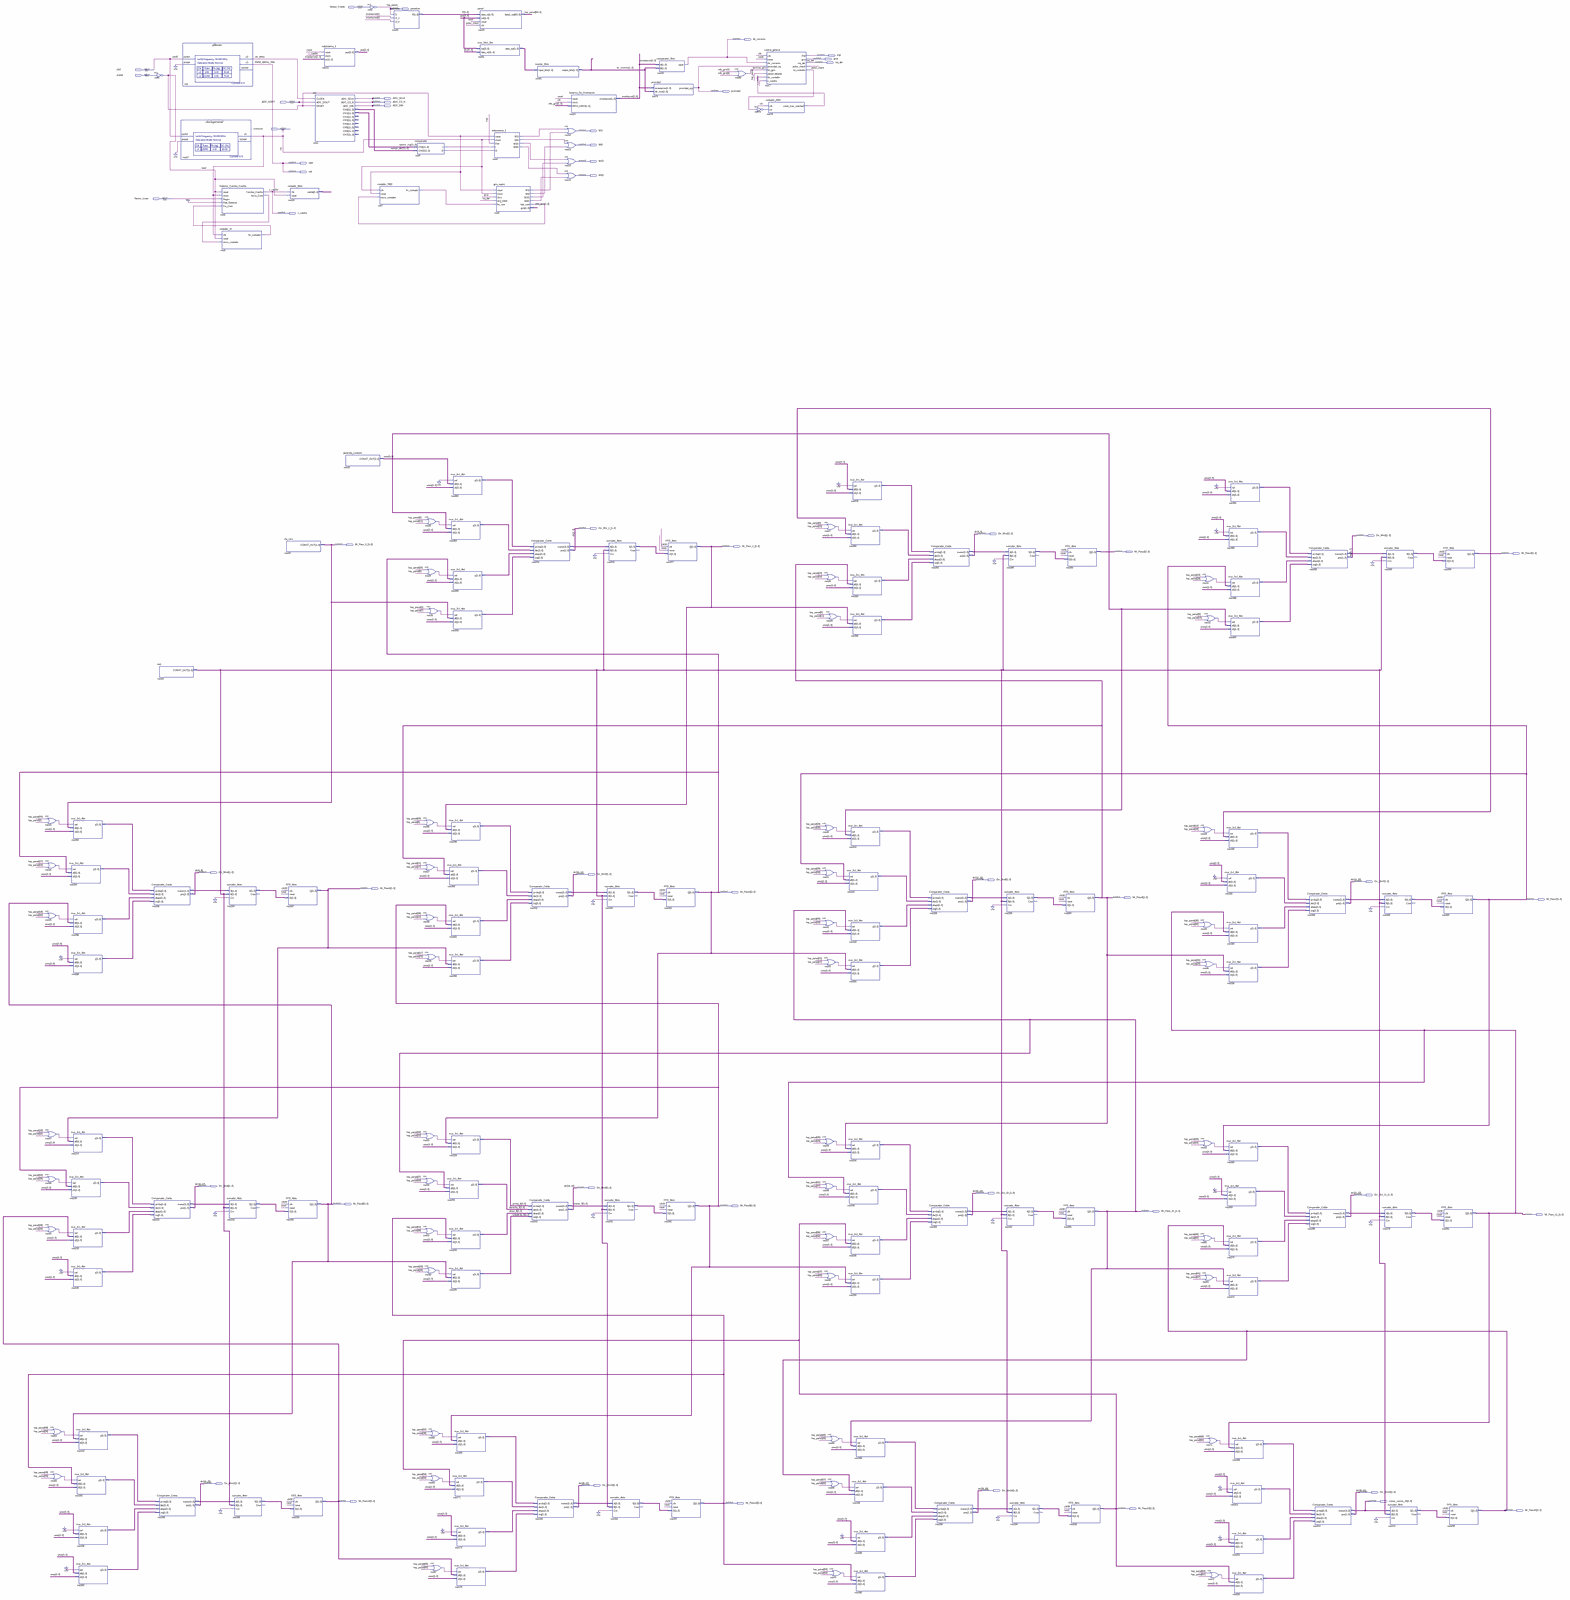
[diagram p0: schematic sheet, whole]
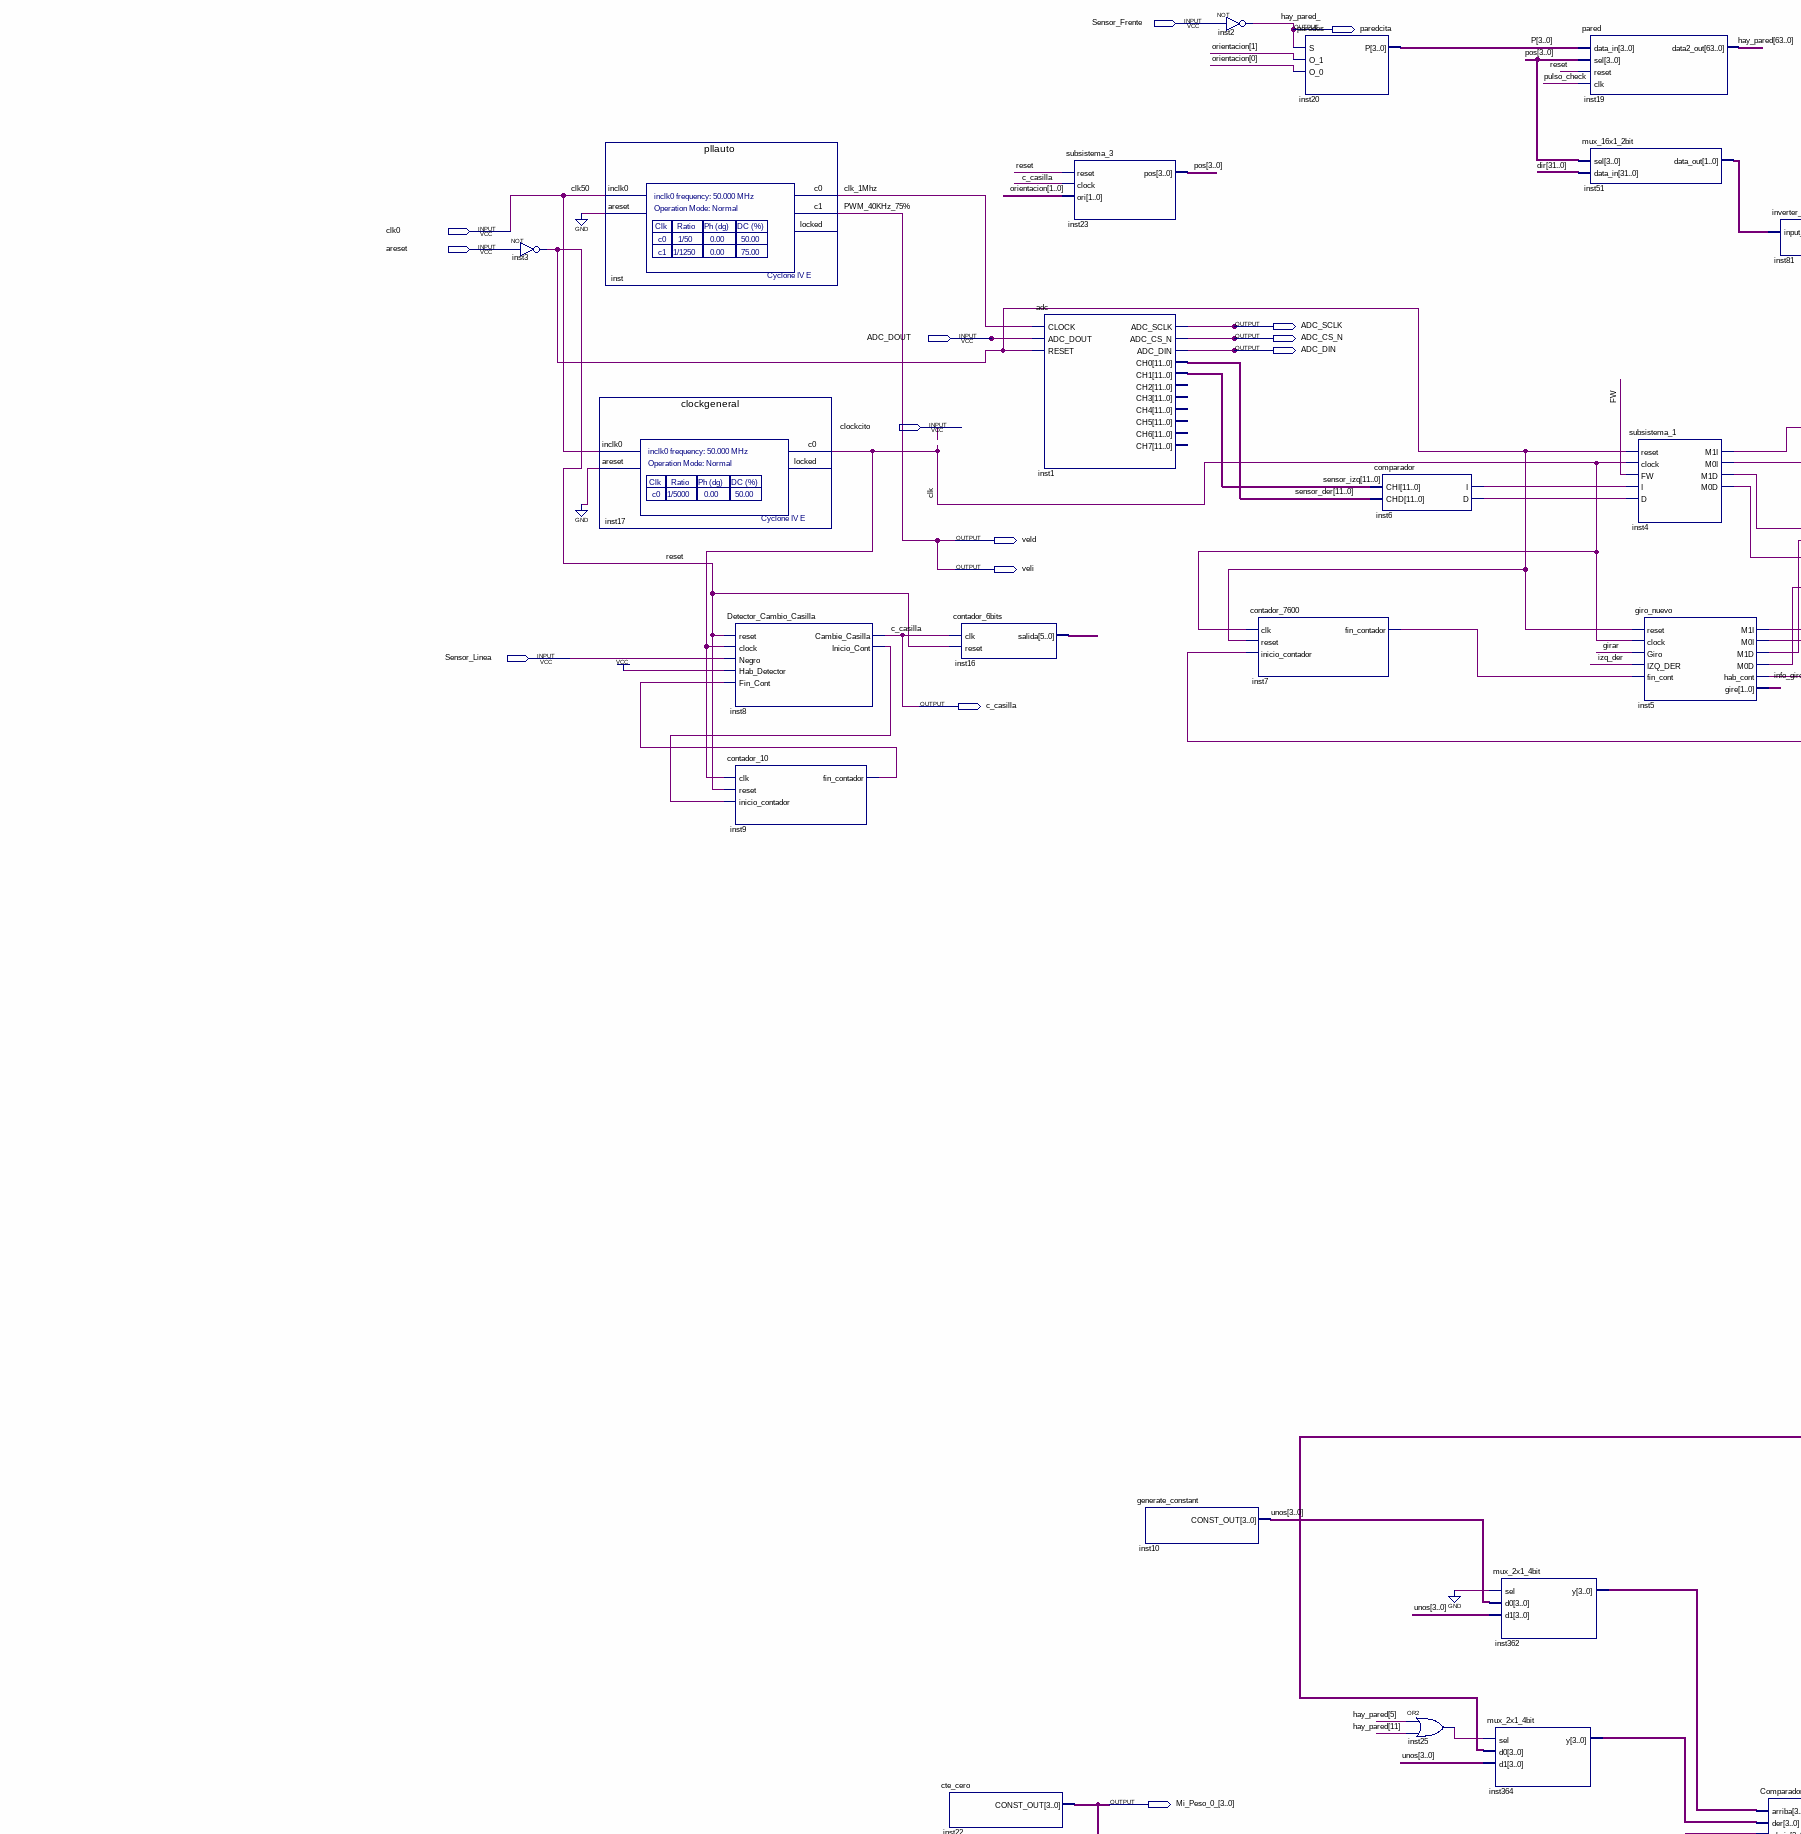
[diagram p1: schematic sheet, upper left part]
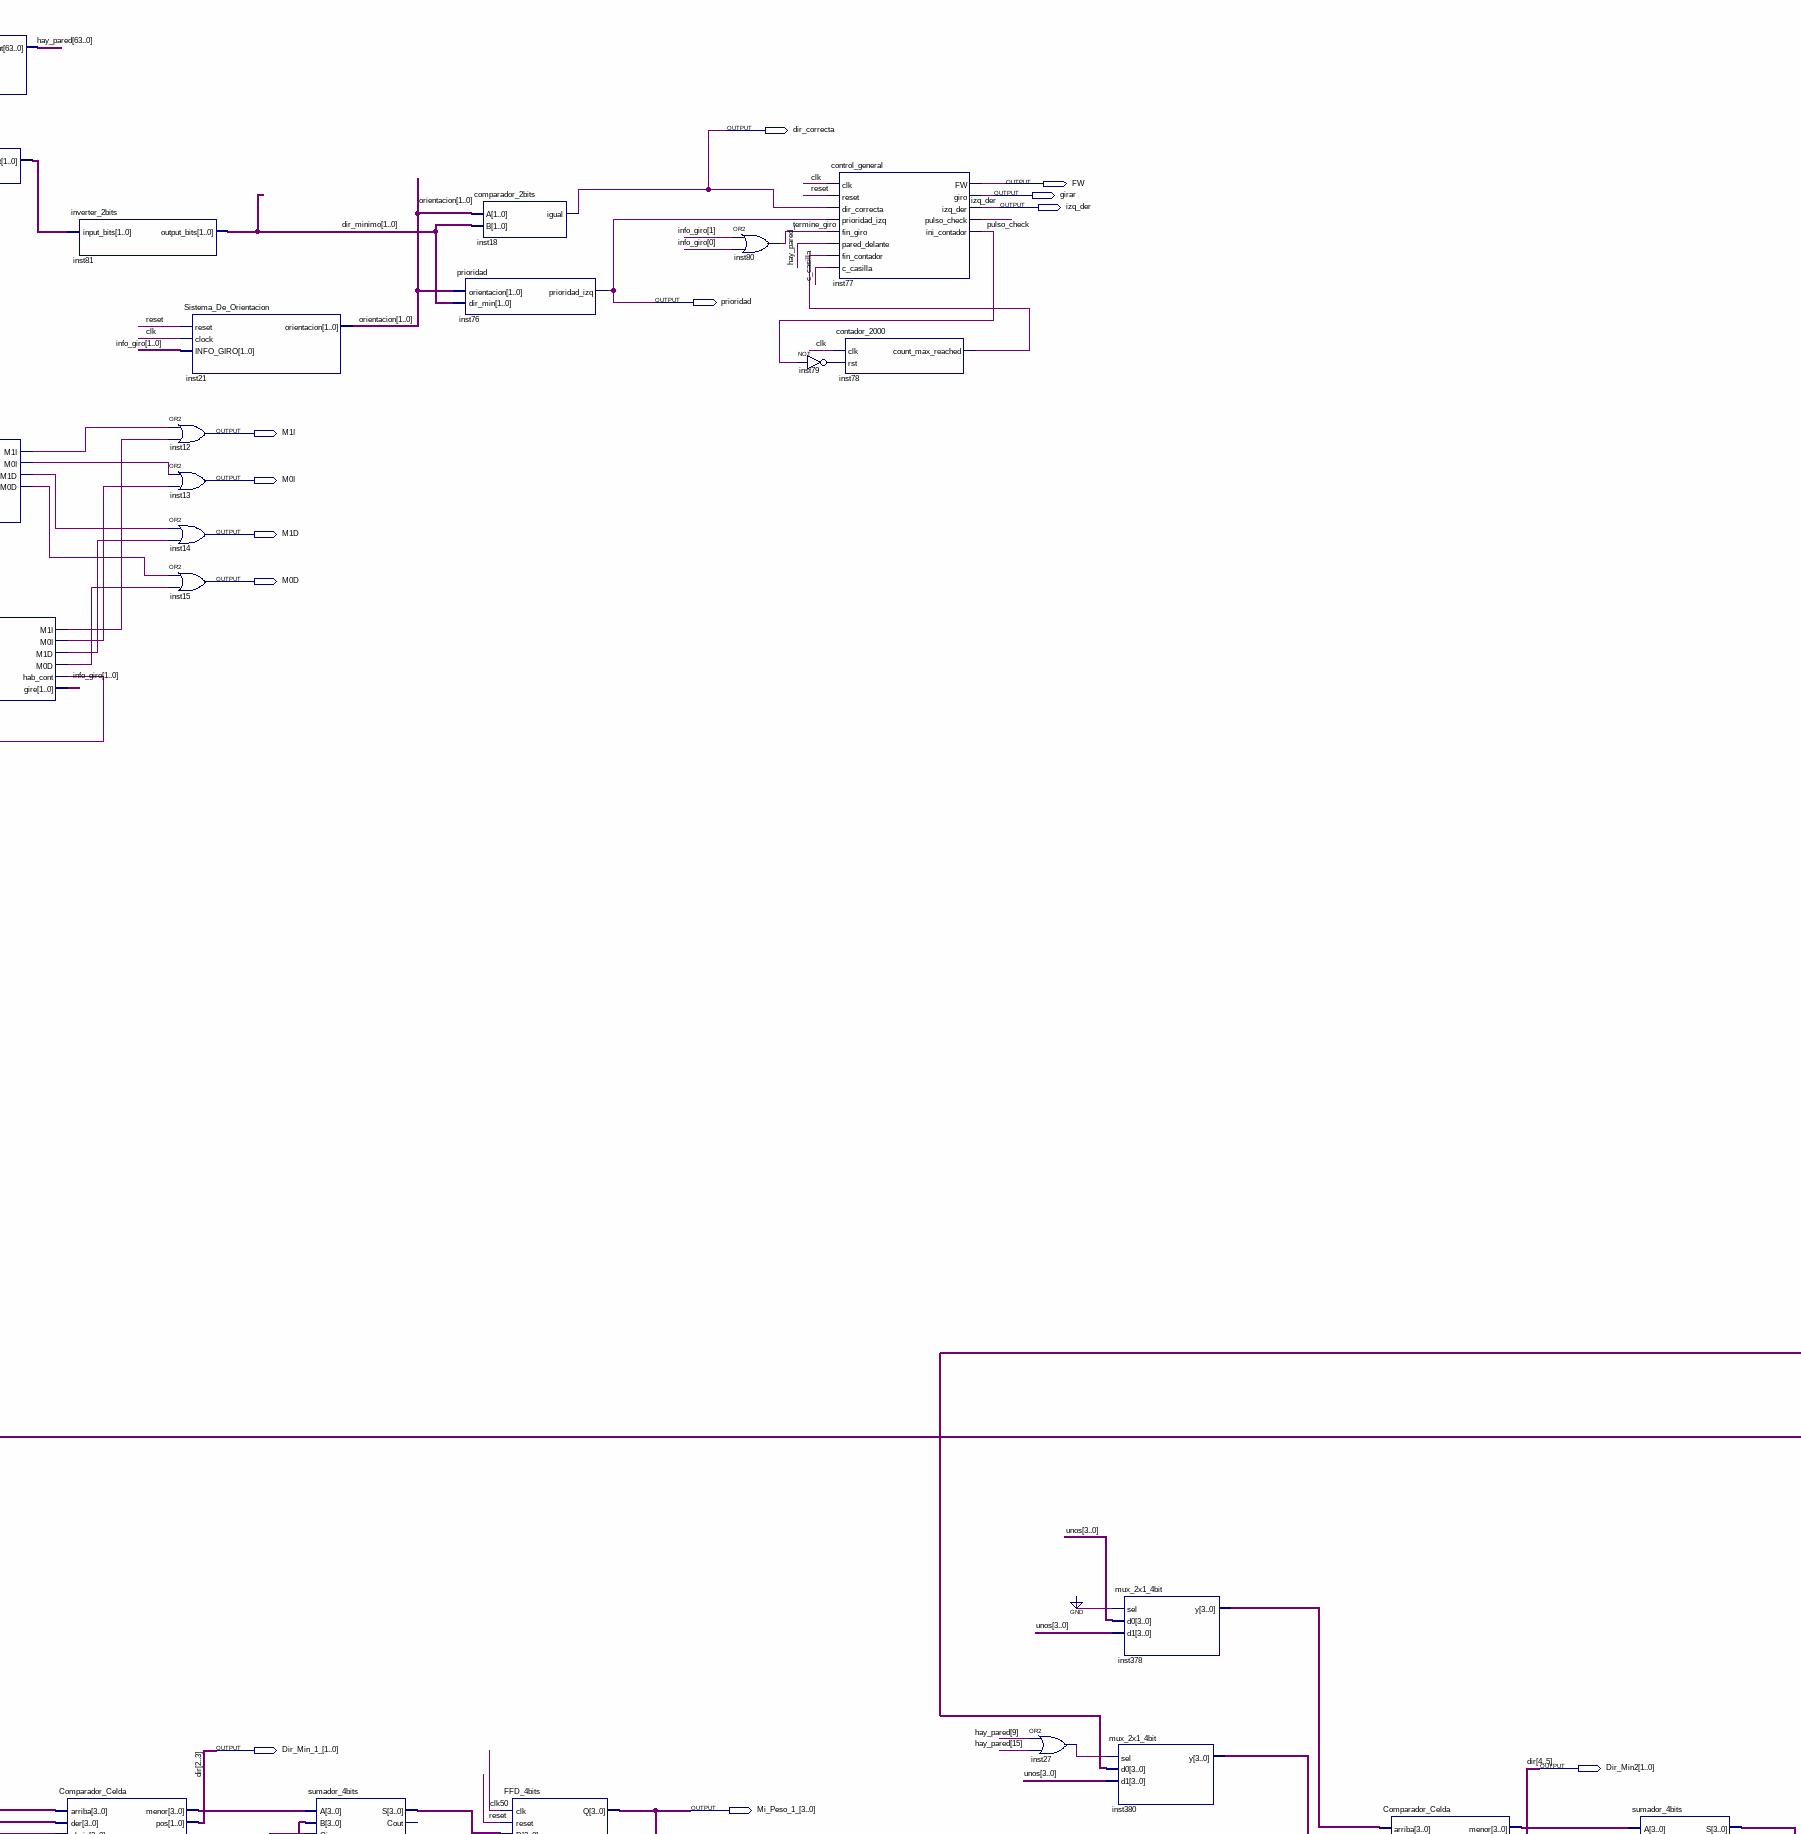
[diagram p2: schematic sheet, upper centre part]
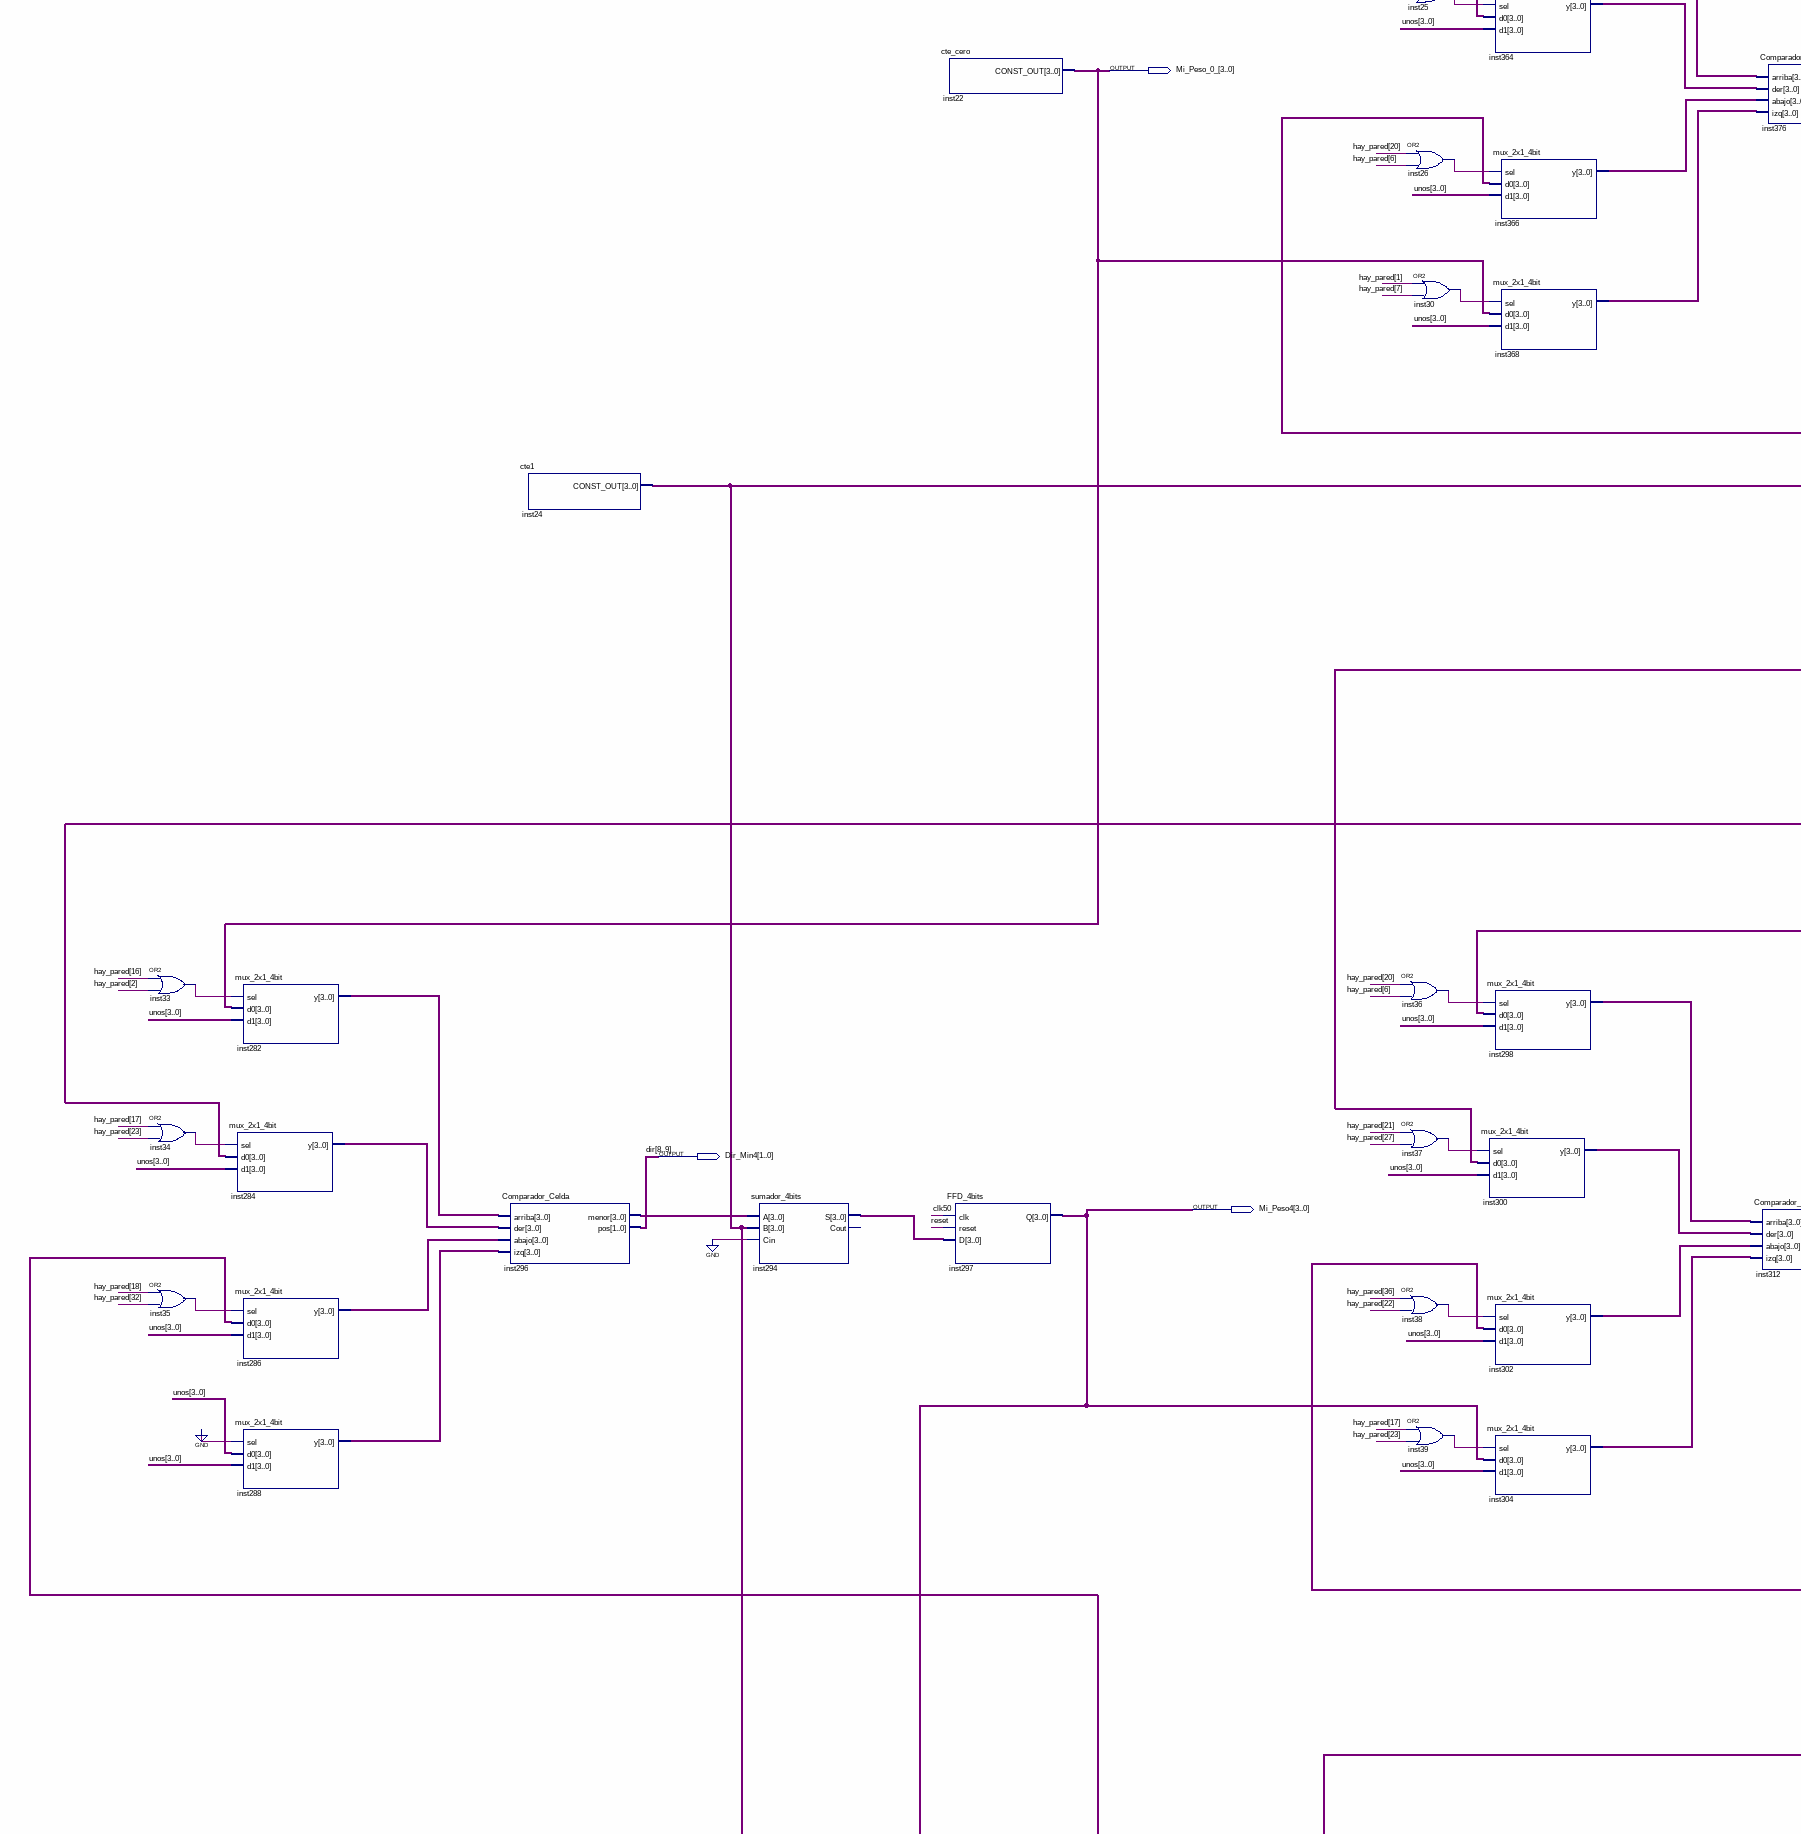
[diagram p3: schematic sheet, middle left part]
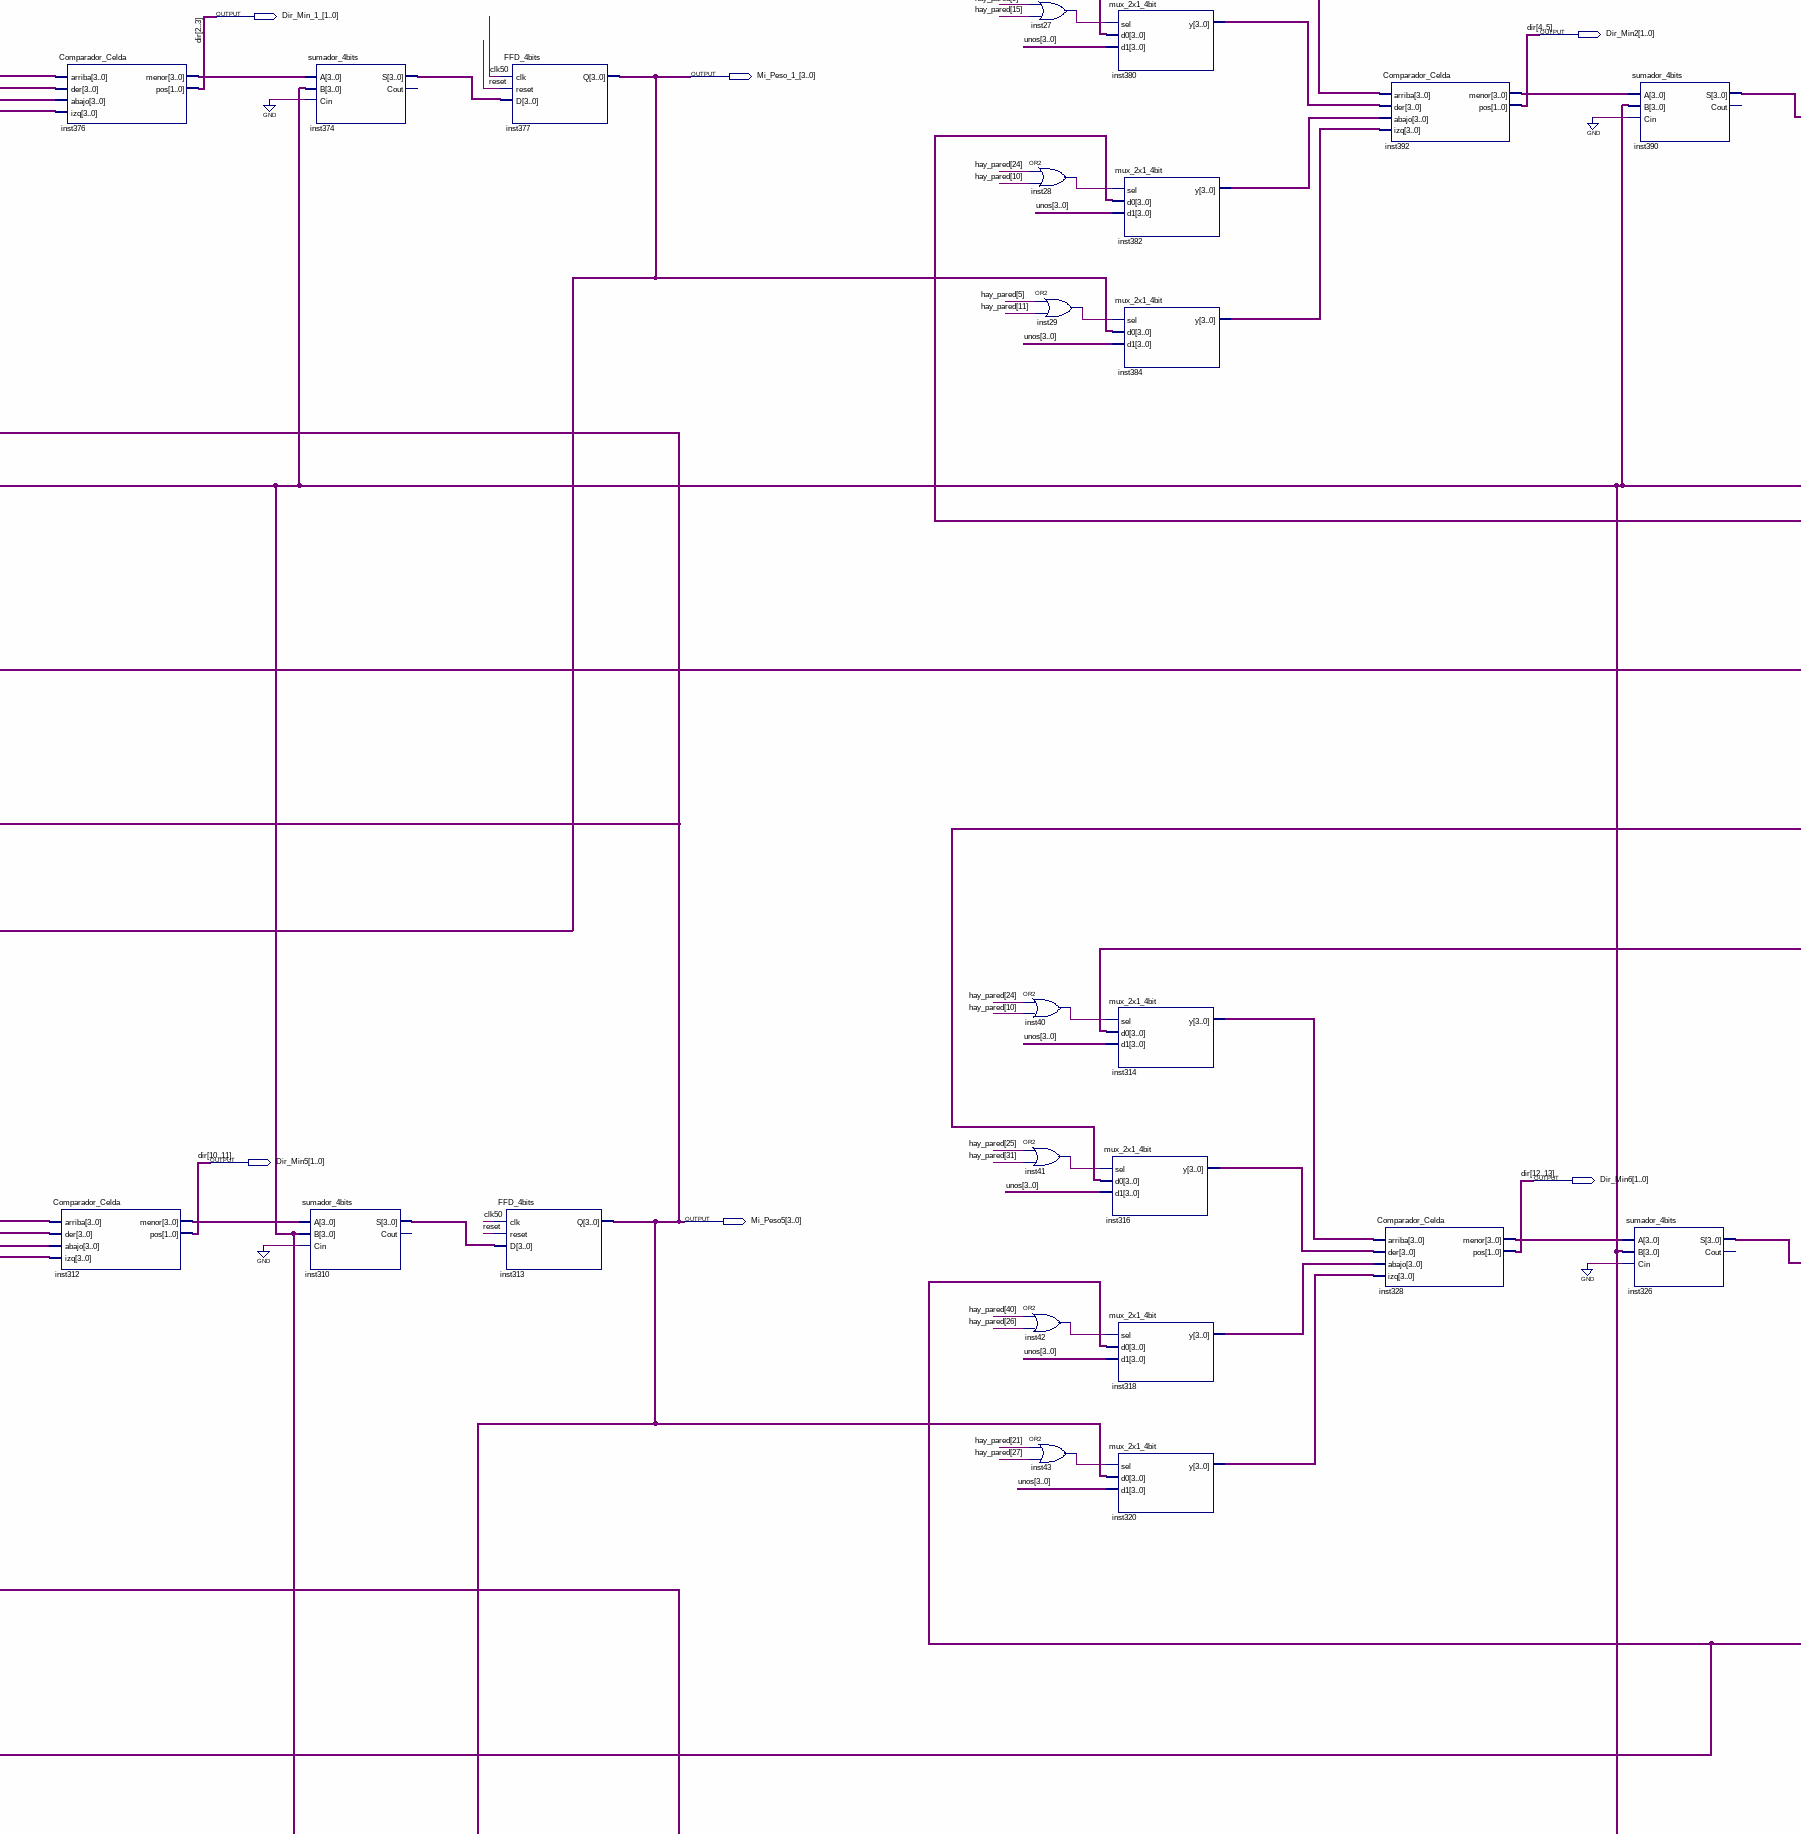
[diagram p4: schematic sheet, middle centre part]
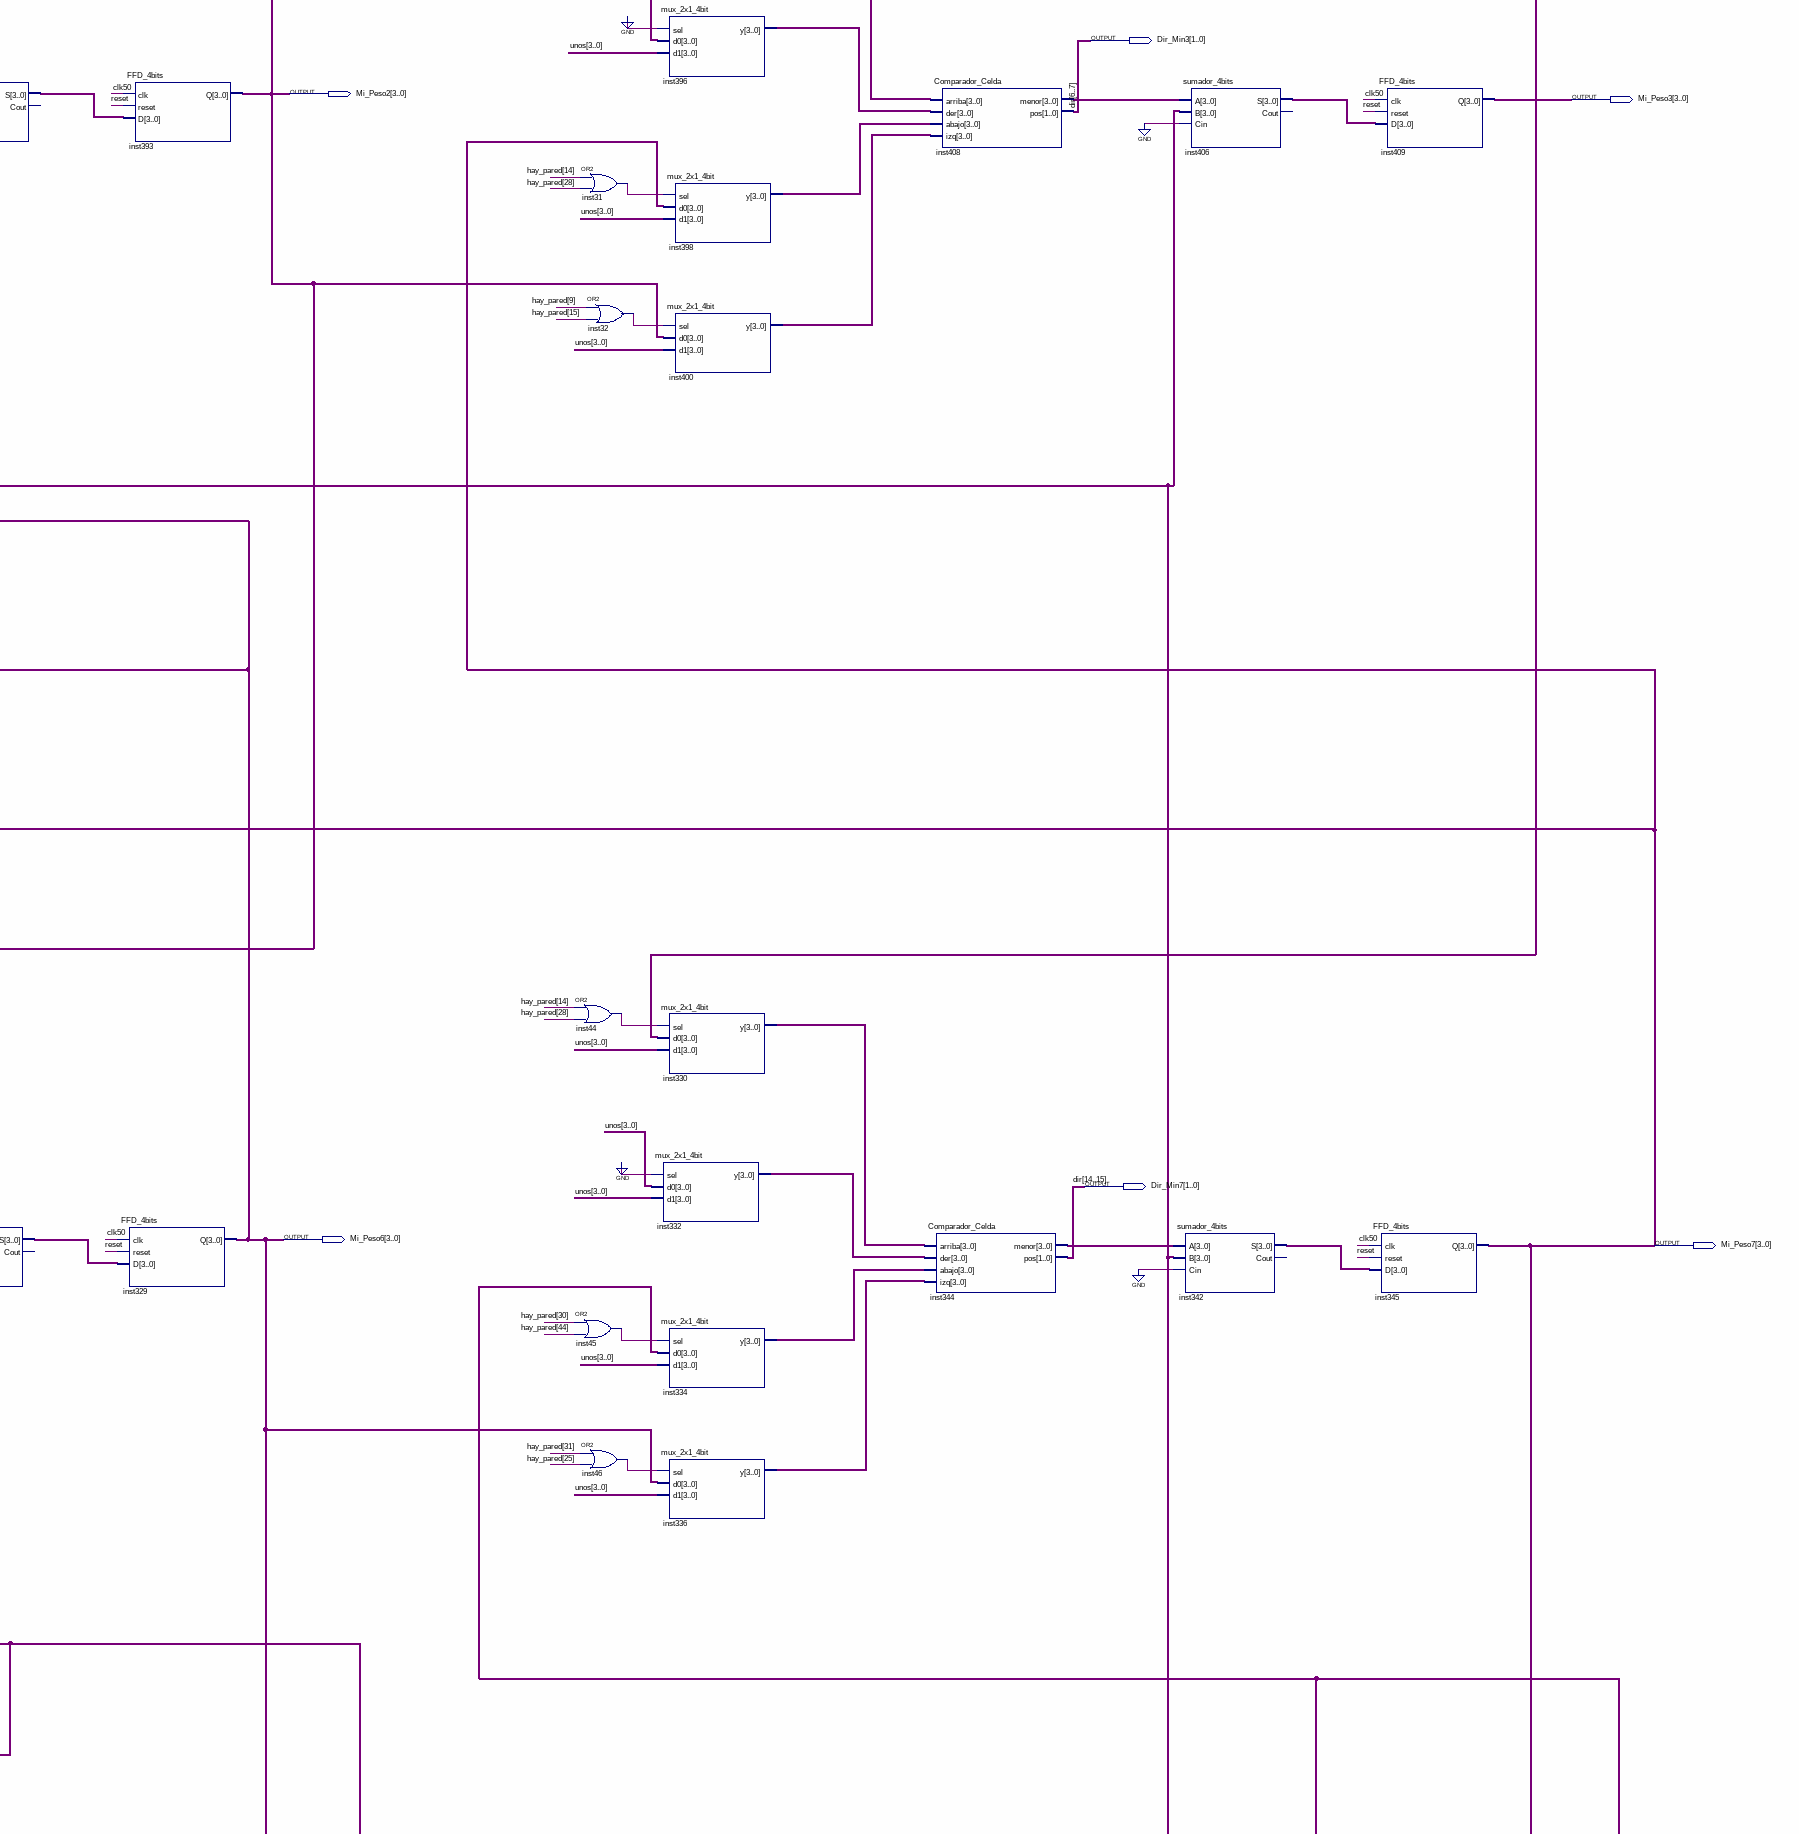
[diagram p5: schematic sheet, middle right part]
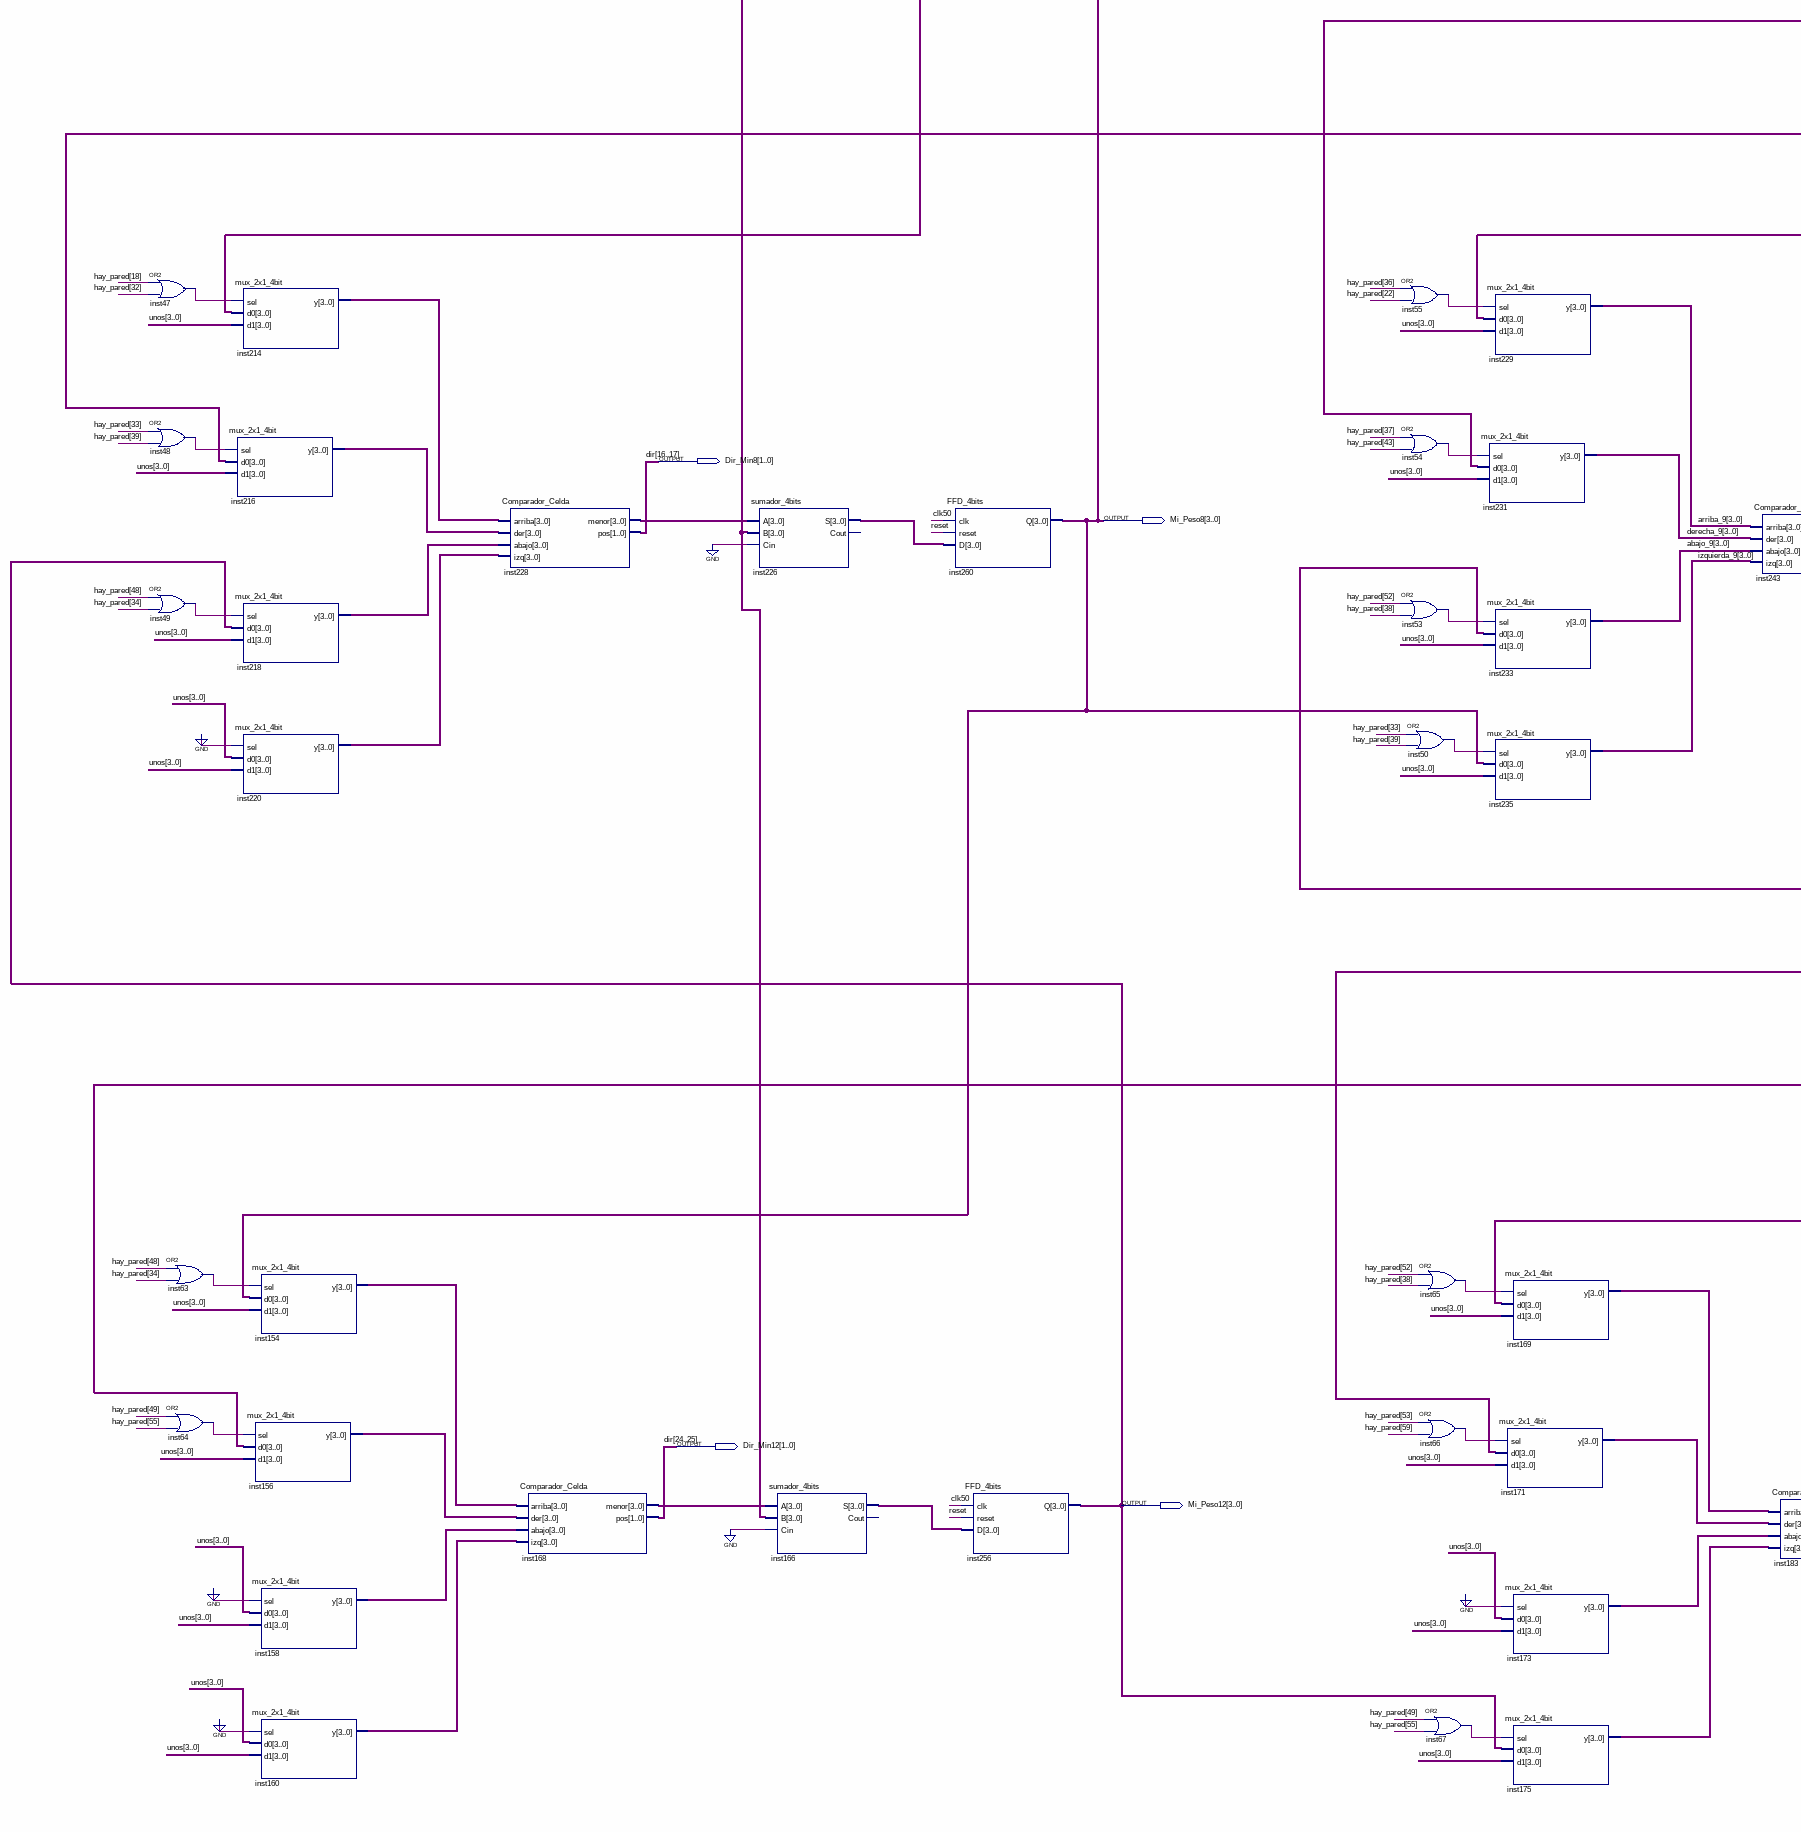
[diagram p6: schematic sheet, lower left part]
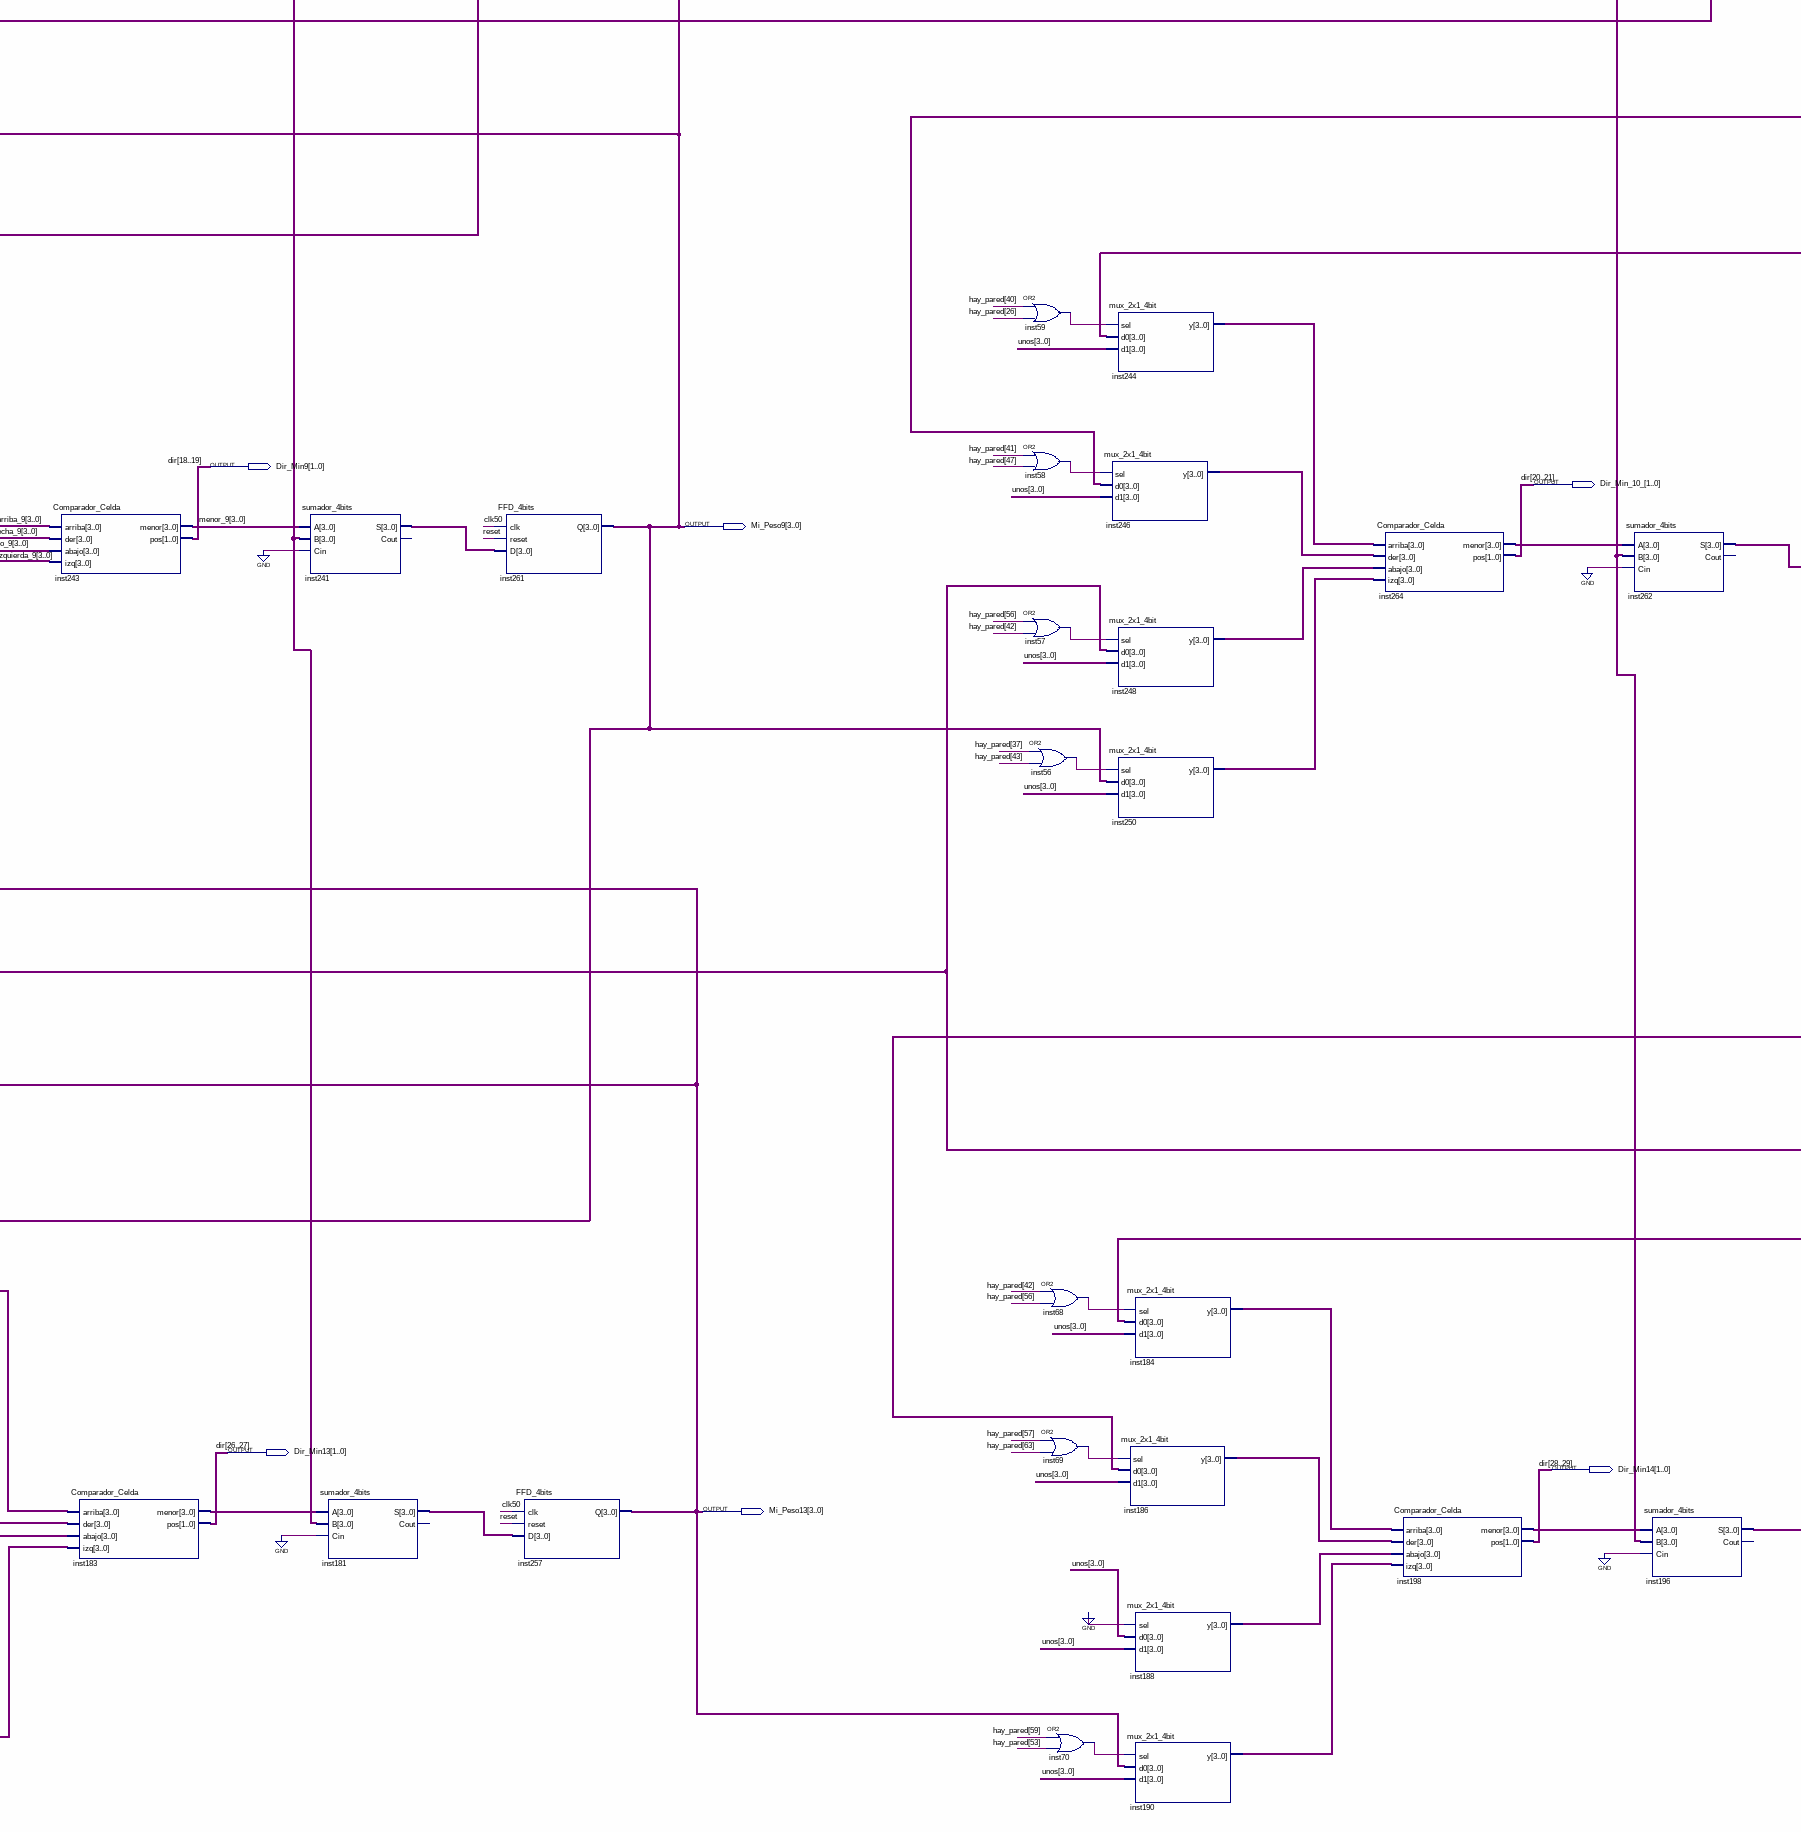
[diagram p7: schematic sheet, lower centre part]
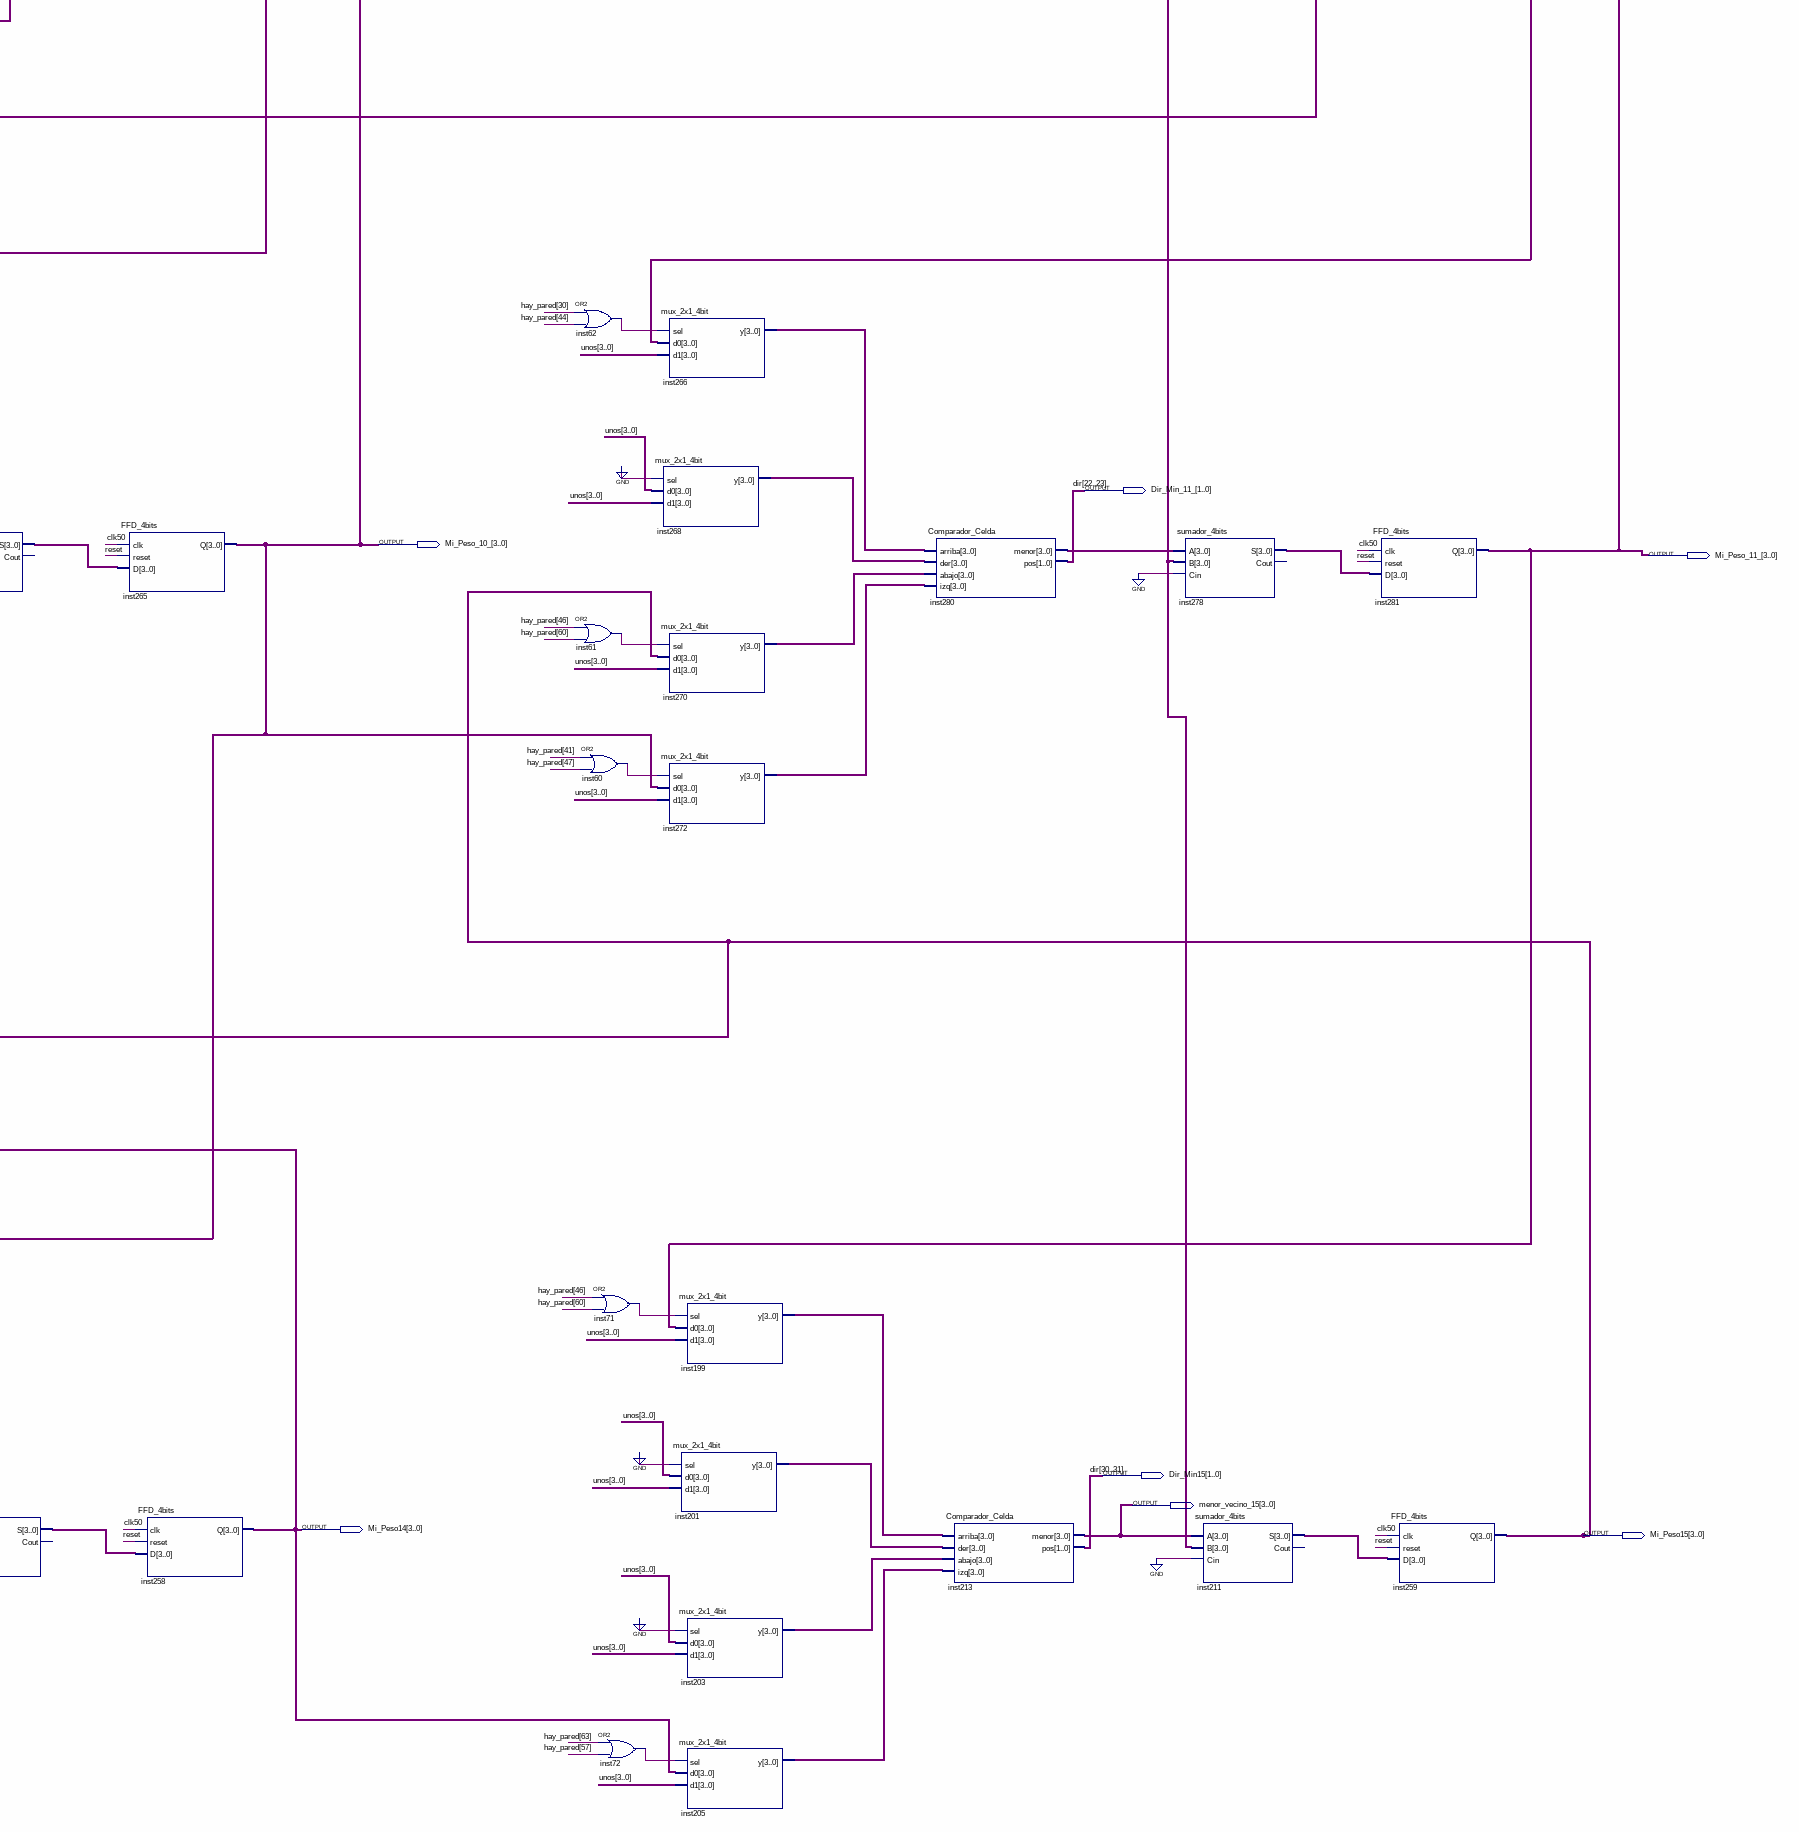
[diagram p8: schematic sheet, lower right part]
// Quartus schematic main.bdf as structural Verilog: 182 symbols, 54 pins
module main (
  input  Sensor_Frente,
  input  clk0,
  input  areset,
  input  ADC_DOUT,
  input  clockcito,
  input  Sensor_Linea,
  output paredcita,
  output dir_correcta,
  output FW,
  output girar,
  output izq_der,
  output prioridad,
  output ADC_SCLK,
  output ADC_CS_N,
  output ADC_DIN,
  output M1I,
  output M0I,
  output M1D,
  output veld,
  output veli,
  output M0D,
  output c_casilla,
  output [1:0] Dir_Min_1_,
  output [1:0] Dir_Min2,
  output [1:0] Dir_Min3,
  output [3:0] Mi_Peso_0_,
  output [3:0] Mi_Peso_1_,
  output [3:0] Mi_Peso2,
  output [3:0] Mi_Peso3,
  output [1:0] Dir_Min4,
  output [1:0] Dir_Min5,
  output [1:0] Dir_Min6,
  output [1:0] Dir_Min7,
  output [3:0] Mi_Peso4,
  output [3:0] Mi_Peso5,
  output [3:0] Mi_Peso6,
  output [3:0] Mi_Peso7,
  output [1:0] Dir_Min8,
  output [1:0] Dir_Min9,
  output [1:0] Dir_Min_10_,
  output [1:0] Dir_Min_11_,
  output [3:0] Mi_Peso8,
  output [3:0] Mi_Peso9,
  output [3:0] Mi_Peso_10_,
  output [3:0] Mi_Peso_11_,
  output [1:0] Dir_Min12,
  output [1:0] Dir_Min13,
  output [1:0] Dir_Min14,
  output [1:0] Dir_Min15,
  output [3:0] Mi_Peso12,
  output [3:0] menor_vecino_15,
  output [3:0] Mi_Peso13,
  output [3:0] Mi_Peso14,
  output [3:0] Mi_Peso15
);

  wire clk, clk_1Mhz, inst4_m0d, inst4_m0i, inst4_m1d, inst4_m1i, inst5_hab_cont, inst5_m0d, inst5_m0i,
       inst5_m1d, inst5_m1i, inst6_d, inst6_i, inst7_fin_contador, inst8_inicio_cont, inst9_fin_contador,
       inst25_out, inst26_out, inst27_out, inst28_out, inst29_out, inst30_out, inst31_out, inst32_out,
       inst33_out, inst34_out, inst35_out, inst36_out, inst37_out, inst38_out, inst39_out, inst40_out,
       inst41_out, inst42_out, inst43_out, inst44_out, inst45_out, inst46_out, inst47_out, inst48_out,
       inst49_out, inst50_out, inst53_out, inst54_out, inst55_out, inst56_out, inst57_out, inst58_out,
       inst59_out, inst60_out, inst61_out, inst62_out, inst63_out, inst64_out, inst65_out, inst66_out,
       inst67_out, inst68_out, inst69_out, inst70_out, inst71_out, inst72_out, inst77_ini_contador,
       inst78_count_max_reached, inst79_out, pulso_check, reset, termine_giro;
  wire [1:0] dir, dir_minimo, info_giro, inst51_data_out, orientacion;
  wire [3:0] abajo_9, arriba_9, derecha_9, inst24_const_out, inst154_y, inst156_y, inst158_y, inst160_y,
       inst166_s, inst168_menor, inst169_y, inst171_y, inst173_y, inst175_y, inst181_s, inst183_menor,
       inst184_y, inst186_y, inst188_y, inst190_y, inst196_s, inst198_menor, inst199_y, inst201_y, inst203_y,
       inst205_y, inst211_s, inst214_y, inst216_y, inst218_y, inst220_y, inst226_s, inst228_menor, inst241_s,
       inst244_y, inst246_y, inst248_y, inst250_y, inst262_s, inst264_menor, inst266_y, inst268_y, inst270_y,
       inst272_y, inst278_s, inst280_menor, inst282_y, inst284_y, inst286_y, inst288_y, inst294_s,
       inst296_menor, inst298_y, inst300_y, inst302_y, inst304_y, inst310_s, inst312_menor, inst314_y,
       inst316_y, inst318_y, inst320_y, inst326_s, inst328_menor, inst330_y, inst332_y, inst334_y, inst336_y,
       inst342_s, inst344_menor, inst362_y, inst364_y, inst366_y, inst368_y, inst374_s, inst376_menor,
       inst378_y, inst380_y, inst382_y, inst384_y, inst390_s, inst392_menor, inst394_y, inst396_y, inst398_y,
       inst400_y, inst406_s, inst408_menor, izquierda_9, menor_9, P, pos, unos;
  wire [5:0] inst16_salida;
  wire [11:0] sensor_der, sensor_izq;
  wire [63:0] hay_pared;

  or inst33 (inst33_out, hay_pared[16], hay_pared[2]);
  or inst34 (inst34_out, hay_pared[17], hay_pared[23]);
  or inst35 (inst35_out, hay_pared[18], hay_pared[32]);
  or inst47 (inst47_out, hay_pared[18], hay_pared[32]);
  or inst48 (inst48_out, hay_pared[33], hay_pared[39]);
  or inst49 (inst49_out, hay_pared[48], hay_pared[34]);
  or inst63 (inst63_out, hay_pared[48], hay_pared[34]);
  or inst64 (inst64_out, hay_pared[49], hay_pared[55]);
  mux_2x1_4bit inst282 (.sel(inst33_out), .d0(Mi_Peso_0_), .d1(unos), .y(inst282_y));
  mux_2x1_4bit inst284 (.sel(inst34_out), .d0(Mi_Peso5), .d1(unos), .y(inst284_y));
  mux_2x1_4bit inst286 (.sel(inst35_out), .d0(Mi_Peso8), .d1(unos), .y(inst286_y));
  mux_2x1_4bit inst288 (.sel(1'b0), .d0(unos), .d1(unos), .y(inst288_y));
  mux_2x1_4bit inst214 (.sel(inst47_out), .d0(Mi_Peso4), .d1(unos), .y(inst214_y));
  mux_2x1_4bit inst216 (.sel(inst48_out), .d0(Mi_Peso9), .d1(unos), .y(inst216_y));
  mux_2x1_4bit inst218 (.sel(inst49_out), .d0(Mi_Peso12), .d1(unos), .y(inst218_y));
  mux_2x1_4bit inst220 (.sel(1'b0), .d0(unos), .d1(unos), .y(inst220_y));
  mux_2x1_4bit inst154 (.sel(inst63_out), .d0(Mi_Peso8), .d1(unos), .y(inst154_y));
  mux_2x1_4bit inst156 (.sel(inst64_out), .d0(Mi_Peso13), .d1(unos), .y(inst156_y));
  mux_2x1_4bit inst158 (.sel(1'b0), .d0(unos), .d1(unos), .y(inst158_y));
  mux_2x1_4bit inst160 (.sel(1'b0), .d0(unos), .d1(unos), .y(inst160_y));
  not inst3 (reset, areset);
  cte1 inst24 (.CONST_OUT(inst24_const_out));
  Comparador_Celda inst296 (
    .arriba(inst282_y), .der(inst284_y), .abajo(inst286_y), .izq(inst288_y), .menor(inst296_menor),
    .pos(Dir_Min4));
  Comparador_Celda inst228 (
    .arriba(inst214_y), .der(inst216_y), .abajo(inst218_y), .izq(inst220_y), .menor(inst228_menor),
    .pos(Dir_Min8));
  Comparador_Celda inst168 (
    .arriba(inst154_y), .der(inst156_y), .abajo(inst158_y), .izq(inst160_y), .menor(inst168_menor),
    .pos(Dir_Min12));
  pllauto inst (.inclk0(clk0), .areset(1'b0), .c0(clk_1Mhz), .c1(veld));  // open: locked
  clockgeneral inst17 (.inclk0(clk0), .areset(1'b0), .c0(clk));  // open: locked
  Detector_Cambio_Casilla inst8 (
    .reset(reset), .clock(clk), .Negro(Sensor_Linea), .Hab_Detector(1'b1), .Fin_Cont(inst9_fin_contador),
    .Cambie_Casilla(c_casilla), .Inicio_Cont(inst8_inicio_cont));
  contador_10 inst9 (.clk(clk), .reset(reset), .inicio_contador(inst8_inicio_cont), .fin_contador(inst9_fin_contador));
  sumador_4bits inst294 (.A(inst296_menor), .B(inst24_const_out), .Cin(1'b0), .S(inst294_s));  // open: Cout
  sumador_4bits inst226 (.A(inst228_menor), .B(inst24_const_out), .Cin(1'b0), .S(inst226_s));  // open: Cout
  sumador_4bits inst166 (.A(inst168_menor), .B(inst24_const_out), .Cin(1'b0), .S(inst166_s));  // open: Cout
  cte_cero inst22 (.CONST_OUT(Mi_Peso_0_));
  FFD_4bits inst297 (.clk(clk0), .reset(reset), .D(inst294_s), .Q(Mi_Peso4));
  FFD_4bits inst260 (.clk(clk0), .reset(reset), .D(inst226_s), .Q(Mi_Peso8));
  contador_6bits inst16 (.clk(c_casilla), .reset(reset), .salida(inst16_salida));
  FFD_4bits inst256 (.clk(clk0), .reset(reset), .D(inst166_s), .Q(Mi_Peso12));
  adc inst1 (
    .CLOCK(clk_1Mhz), .ADC_DOUT(ADC_DOUT), .RESET(reset), .ADC_SCLK(ADC_SCLK), .ADC_CS_N(ADC_CS_N),
    .ADC_DIN(ADC_DIN), .CH0(sensor_der), .CH1(sensor_izq));  // open: CH2, CH3, CH4, CH5, CH6, CH7
  subsistema_3 inst23 (.reset(reset), .clock(c_casilla), .ori(orientacion), .pos(pos));
  generate_constant inst10 (.CONST_OUT(unos));
  not inst2 (paredcita, Sensor_Frente);
  contador_7600 inst7 (.clk(clk), .reset(reset), .inicio_contador(inst5_hab_cont), .fin_contador(inst7_fin_contador));
  paredes inst20 (.S(paredcita), .O_1(orientacion[1]), .O_0(orientacion[0]), .P(P));
  comparador inst6 (.CHI(sensor_izq), .CHD(sensor_der), .I(inst6_i), .D(inst6_d));
  or inst25 (inst25_out, hay_pared[5], hay_pared[11]);
  or inst26 (inst26_out, hay_pared[20], hay_pared[6]);
  or inst30 (inst30_out, hay_pared[1], hay_pared[7]);
  or inst36 (inst36_out, hay_pared[20], hay_pared[6]);
  or inst37 (inst37_out, hay_pared[21], hay_pared[27]);
  or inst38 (inst38_out, hay_pared[36], hay_pared[22]);
  or inst39 (inst39_out, hay_pared[17], hay_pared[23]);
  or inst55 (inst55_out, hay_pared[36], hay_pared[22]);
  or inst54 (inst54_out, hay_pared[37], hay_pared[43]);
  or inst53 (inst53_out, hay_pared[52], hay_pared[38]);
  or inst50 (inst50_out, hay_pared[33], hay_pared[39]);
  or inst65 (inst65_out, hay_pared[52], hay_pared[38]);
  or inst66 (inst66_out, hay_pared[53], hay_pared[59]);
  or inst67 (inst67_out, hay_pared[49], hay_pared[55]);
  mux_2x1_4bit inst362 (.sel(1'b0), .d0(unos), .d1(unos), .y(inst362_y));
  mux_2x1_4bit inst364 (.sel(inst25_out), .d0(Mi_Peso2), .d1(unos), .y(inst364_y));
  mux_2x1_4bit inst366 (.sel(inst26_out), .d0(Mi_Peso5), .d1(unos), .y(inst366_y));
  mux_2x1_4bit inst368 (.sel(inst30_out), .d0(Mi_Peso_0_), .d1(unos), .y(inst368_y));
  mux_2x1_4bit inst298 (.sel(inst36_out), .d0(Mi_Peso_1_), .d1(unos), .y(inst298_y));
  mux_2x1_4bit inst300 (.sel(inst37_out), .d0(Mi_Peso6), .d1(unos), .y(inst300_y));
  mux_2x1_4bit inst302 (.sel(inst38_out), .d0(Mi_Peso9), .d1(unos), .y(inst302_y));
  mux_2x1_4bit inst304 (.sel(inst39_out), .d0(Mi_Peso4), .d1(unos), .y(inst304_y));
  mux_2x1_4bit inst229 (.sel(inst55_out), .d0(Mi_Peso5), .d1(unos), .y(arriba_9));
  mux_2x1_4bit inst231 (.sel(inst54_out), .d0(Mi_Peso_10_), .d1(unos), .y(derecha_9));
  mux_2x1_4bit inst233 (.sel(inst53_out), .d0(Mi_Peso13), .d1(unos), .y(abajo_9));
  mux_2x1_4bit inst235 (.sel(inst50_out), .d0(Mi_Peso8), .d1(unos), .y(izquierda_9));
  mux_2x1_4bit inst169 (.sel(inst65_out), .d0(Mi_Peso9), .d1(unos), .y(inst169_y));
  mux_2x1_4bit inst171 (.sel(inst66_out), .d0(Mi_Peso14), .d1(unos), .y(inst171_y));
  mux_2x1_4bit inst173 (.sel(1'b0), .d0(unos), .d1(unos), .y(inst173_y));
  mux_2x1_4bit inst175 (.sel(inst67_out), .d0(Mi_Peso12), .d1(unos), .y(inst175_y));
  pared inst19 (.data_in(P), .sel(pos), .reset(reset), .clk(pulso_check), .data2_out(hay_pared));
  mux_16x1_2bit inst51 (
    .sel(pos),
    .data_in({Dir_Min15[0], Dir_Min15[1], Dir_Min14[0], Dir_Min14[1], Dir_Min13[0], Dir_Min13[1], Dir_Min12[0], Dir_Min12[1], Dir_Min_11_[0], Dir_Min_11_[1], Dir_Min_10_[0], Dir_Min_10_[1], Dir_Min9[0], Dir_Min9[1], Dir_Min8[0], Dir_Min8[1], Dir_Min7[0], Dir_Min7[1], Dir_Min6[0], Dir_Min6[1], Dir_Min5[0], Dir_Min5[1], Dir_Min4[0], Dir_Min4[1], Dir_Min3[0], Dir_Min3[1], Dir_Min2[0], Dir_Min2[1], Dir_Min_1_[0], Dir_Min_1_[1], dir}),
    .data_out(inst51_data_out));
  subsistema_1 inst4 (
    .reset(reset), .clock(clk), .FW(FW), .I(inst6_i), .D(inst6_d), .M1I(inst4_m1i), .M0I(inst4_m0i),
    .M1D(inst4_m1d), .M0D(inst4_m0d));
  giro_nuevo inst5 (
    .reset(reset), .clock(clk), .Giro(girar), .IZQ_DER(izq_der), .fin_cont(inst7_fin_contador),
    .M1I(inst5_m1i), .M0I(inst5_m0i), .M1D(inst5_m1d), .M0D(inst5_m0d), .hab_cont(inst5_hab_cont),
    .gire(info_giro));
  Comparador_Celda inst312 (
    .arriba(inst298_y), .der(inst300_y), .abajo(inst302_y), .izq(inst304_y), .menor(inst312_menor),
    .pos(Dir_Min5));
  Comparador_Celda inst243 (
    .arriba(arriba_9), .der(derecha_9), .abajo(abajo_9), .izq(izquierda_9), .menor(menor_9), .pos(Dir_Min9));
  inverter_2bits inst81 (.input_bits(inst51_data_out), .output_bits(dir_minimo));
  Comparador_Celda inst376 (
    .arriba(inst362_y), .der(inst364_y), .abajo(inst366_y), .izq(inst368_y), .menor(inst376_menor),
    .pos(Dir_Min_1_));
  Comparador_Celda inst183 (
    .arriba(inst169_y), .der(inst171_y), .abajo(inst173_y), .izq(inst175_y), .menor(inst183_menor),
    .pos(Dir_Min13));
  Sistema_De_Orientacion inst21 (.reset(reset), .clock(clk), .INFO_GIRO(info_giro), .orientacion(orientacion));
  or inst12 (M1I, inst4_m1i, inst5_m1i);
  or inst13 (M0I, inst4_m0i, inst5_m0i);
  or inst14 (M1D, inst4_m1d, inst5_m1d);
  or inst15 (M0D, inst4_m0d, inst5_m0d);
  sumador_4bits inst374 (.A(inst376_menor), .B(inst24_const_out), .Cin(1'b0), .S(inst374_s));  // open: Cout
  sumador_4bits inst310 (.A(inst312_menor), .B(inst24_const_out), .Cin(1'b0), .S(inst310_s));  // open: Cout
  sumador_4bits inst241 (.A(menor_9), .B(inst24_const_out), .Cin(1'b0), .S(inst241_s));  // open: Cout
  sumador_4bits inst181 (.A(inst183_menor), .B(inst24_const_out), .Cin(1'b0), .S(inst181_s));  // open: Cout
  comparador_2bits inst18 (.A(orientacion), .B(dir_minimo), .igual(dir_correcta));
  prioridad inst76 (.orientacion(orientacion), .dir_min(dir_minimo), .prioridad_izq(prioridad));
  FFD_4bits inst377 (.clk(clk0), .reset(reset), .D(inst374_s), .Q(Mi_Peso_1_));
  FFD_4bits inst313 (.clk(clk0), .reset(reset), .D(inst310_s), .Q(Mi_Peso5));
  FFD_4bits inst261 (.clk(clk0), .reset(reset), .D(inst241_s), .Q(Mi_Peso9));
  FFD_4bits inst257 (.clk(clk0), .reset(reset), .D(inst181_s), .Q(Mi_Peso13));
  or inst80 (termine_giro, info_giro[1], info_giro[0]);
  not inst79 (inst79_out, inst77_ini_contador);
  control_general inst77 (
    .clk(clk), .reset(reset), .dir_correcta(dir_correcta), .prioridad_izq(prioridad),
    .fin_giro(termine_giro), .pared_delante(paredcita), .fin_contador(inst78_count_max_reached),
    .c_casilla(c_casilla), .FW(FW), .giro(girar), .izq_der(izq_der), .pulso_check(pulso_check),
    .ini_contador(inst77_ini_contador));
  contador_2000 inst78 (.clk(clk), .rst(inst79_out), .count_max_reached(inst78_count_max_reached));
  or inst27 (inst27_out, hay_pared[9], hay_pared[15]);
  or inst28 (inst28_out, hay_pared[24], hay_pared[10]);
  or inst29 (inst29_out, hay_pared[5], hay_pared[11]);
  or inst40 (inst40_out, hay_pared[24], hay_pared[10]);
  or inst41 (inst41_out, hay_pared[25], hay_pared[31]);
  or inst42 (inst42_out, hay_pared[40], hay_pared[26]);
  or inst43 (inst43_out, hay_pared[21], hay_pared[27]);
  or inst59 (inst59_out, hay_pared[40], hay_pared[26]);
  or inst58 (inst58_out, hay_pared[41], hay_pared[47]);
  or inst57 (inst57_out, hay_pared[56], hay_pared[42]);
  or inst56 (inst56_out, hay_pared[37], hay_pared[43]);
  or inst68 (inst68_out, hay_pared[42], hay_pared[56]);
  or inst69 (inst69_out, hay_pared[57], hay_pared[63]);
  or inst70 (inst70_out, hay_pared[59], hay_pared[53]);
  mux_2x1_4bit inst378 (.sel(1'b0), .d0(unos), .d1(unos), .y(inst378_y));
  mux_2x1_4bit inst380 (.sel(inst27_out), .d0(Mi_Peso3), .d1(unos), .y(inst380_y));
  mux_2x1_4bit inst382 (.sel(inst28_out), .d0(Mi_Peso6), .d1(unos), .y(inst382_y));
  mux_2x1_4bit inst384 (.sel(inst29_out), .d0(Mi_Peso_1_), .d1(unos), .y(inst384_y));
  mux_2x1_4bit inst314 (.sel(inst40_out), .d0(Mi_Peso2), .d1(unos), .y(inst314_y));
  mux_2x1_4bit inst316 (.sel(inst41_out), .d0(Mi_Peso7), .d1(unos), .y(inst316_y));
  mux_2x1_4bit inst318 (.sel(inst42_out), .d0(Mi_Peso_10_), .d1(unos), .y(inst318_y));
  mux_2x1_4bit inst320 (.sel(inst43_out), .d0(Mi_Peso5), .d1(unos), .y(inst320_y));
  mux_2x1_4bit inst244 (.sel(inst59_out), .d0(Mi_Peso6), .d1(unos), .y(inst244_y));
  mux_2x1_4bit inst246 (.sel(inst58_out), .d0(Mi_Peso_11_), .d1(unos), .y(inst246_y));
  mux_2x1_4bit inst248 (.sel(inst57_out), .d0(Mi_Peso14), .d1(unos), .y(inst248_y));
  mux_2x1_4bit inst250 (.sel(inst56_out), .d0(Mi_Peso9), .d1(unos), .y(inst250_y));
  mux_2x1_4bit inst184 (.sel(inst68_out), .d0(Mi_Peso_10_), .d1(unos), .y(inst184_y));
  mux_2x1_4bit inst186 (.sel(inst69_out), .d0(Mi_Peso15), .d1(unos), .y(inst186_y));
  mux_2x1_4bit inst188 (.sel(1'b0), .d0(unos), .d1(unos), .y(inst188_y));
  mux_2x1_4bit inst190 (.sel(inst70_out), .d0(Mi_Peso13), .d1(unos), .y(inst190_y));
  Comparador_Celda inst392 (
    .arriba(inst378_y), .der(inst380_y), .abajo(inst382_y), .izq(inst384_y), .menor(inst392_menor),
    .pos(Dir_Min2));
  Comparador_Celda inst328 (
    .arriba(inst314_y), .der(inst316_y), .abajo(inst318_y), .izq(inst320_y), .menor(inst328_menor),
    .pos(Dir_Min6));
  Comparador_Celda inst264 (
    .arriba(inst244_y), .der(inst246_y), .abajo(inst248_y), .izq(inst250_y), .menor(inst264_menor),
    .pos(Dir_Min_10_));
  Comparador_Celda inst198 (
    .arriba(inst184_y), .der(inst186_y), .abajo(inst188_y), .izq(inst190_y), .menor(inst198_menor),
    .pos(Dir_Min14));
  sumador_4bits inst390 (.A(inst392_menor), .B(inst24_const_out), .Cin(1'b0), .S(inst390_s));  // open: Cout
  sumador_4bits inst326 (.A(inst328_menor), .B(inst24_const_out), .Cin(1'b0), .S(inst326_s));  // open: Cout
  sumador_4bits inst262 (.A(inst264_menor), .B(inst24_const_out), .Cin(1'b0), .S(inst262_s));  // open: Cout
  sumador_4bits inst196 (.A(inst198_menor), .B(inst24_const_out), .Cin(1'b0), .S(inst196_s));  // open: Cout
  FFD_4bits inst393 (.clk(clk0), .reset(reset), .D(inst390_s), .Q(Mi_Peso2));
  FFD_4bits inst329 (.clk(clk0), .reset(reset), .D(inst326_s), .Q(Mi_Peso6));
  FFD_4bits inst265 (.clk(clk0), .reset(reset), .D(inst262_s), .Q(Mi_Peso_10_));
  FFD_4bits inst258 (.clk(clk0), .reset(reset), .D(inst196_s), .Q(Mi_Peso14));
  or inst31 (inst31_out, hay_pared[14], hay_pared[28]);
  or inst44 (inst44_out, hay_pared[14], hay_pared[28]);
  or inst45 (inst45_out, hay_pared[30], hay_pared[44]);
  or inst46 (inst46_out, hay_pared[31], hay_pared[25]);
  or inst62 (inst62_out, hay_pared[30], hay_pared[44]);
  or inst61 (inst61_out, hay_pared[46], hay_pared[60]);
  or inst60 (inst60_out, hay_pared[41], hay_pared[47]);
  or inst32 (inst32_out, hay_pared[9], hay_pared[15]);
  or inst71 (inst71_out, hay_pared[46], hay_pared[60]);
  or inst72 (inst72_out, hay_pared[63], hay_pared[57]);
  mux_2x1_4bit inst394 (.sel(1'b0), .d0(unos), .d1(unos), .y(inst394_y));
  mux_2x1_4bit inst396 (.sel(1'b0), .d0(unos), .d1(unos), .y(inst396_y));
  mux_2x1_4bit inst398 (.sel(inst31_out), .d0(Mi_Peso7), .d1(unos), .y(inst398_y));
  mux_2x1_4bit inst400 (.sel(inst32_out), .d0(Mi_Peso2), .d1(unos), .y(inst400_y));
  mux_2x1_4bit inst330 (.sel(inst44_out), .d0(Mi_Peso3), .d1(unos), .y(inst330_y));
  mux_2x1_4bit inst332 (.sel(1'b0), .d0(unos), .d1(unos), .y(inst332_y));
  mux_2x1_4bit inst334 (.sel(inst45_out), .d0(Mi_Peso_11_), .d1(unos), .y(inst334_y));
  mux_2x1_4bit inst336 (.sel(inst46_out), .d0(Mi_Peso6), .d1(unos), .y(inst336_y));
  mux_2x1_4bit inst266 (.sel(inst62_out), .d0(Mi_Peso7), .d1(unos), .y(inst266_y));
  mux_2x1_4bit inst268 (.sel(1'b0), .d0(unos), .d1(unos), .y(inst268_y));
  mux_2x1_4bit inst270 (.sel(inst61_out), .d0(Mi_Peso15), .d1(unos), .y(inst270_y));
  mux_2x1_4bit inst272 (.sel(inst60_out), .d0(Mi_Peso_10_), .d1(unos), .y(inst272_y));
  mux_2x1_4bit inst199 (.sel(inst71_out), .d0(Mi_Peso_11_), .d1(unos), .y(inst199_y));
  mux_2x1_4bit inst201 (.sel(1'b0), .d0(unos), .d1(unos), .y(inst201_y));
  mux_2x1_4bit inst203 (.sel(1'b0), .d0(unos), .d1(unos), .y(inst203_y));
  mux_2x1_4bit inst205 (.sel(inst72_out), .d0(Mi_Peso14), .d1(unos), .y(inst205_y));
  Comparador_Celda inst408 (
    .arriba(inst394_y), .der(inst396_y), .abajo(inst398_y), .izq(inst400_y), .menor(inst408_menor),
    .pos(Dir_Min3));
  Comparador_Celda inst344 (
    .arriba(inst330_y), .der(inst332_y), .abajo(inst334_y), .izq(inst336_y), .menor(inst344_menor),
    .pos(Dir_Min7));
  Comparador_Celda inst280 (
    .arriba(inst266_y), .der(inst268_y), .abajo(inst270_y), .izq(inst272_y), .menor(inst280_menor),
    .pos(Dir_Min_11_));
  Comparador_Celda inst213 (
    .arriba(inst199_y), .der(inst201_y), .abajo(inst203_y), .izq(inst205_y), .menor(menor_vecino_15),
    .pos(Dir_Min15));
  sumador_4bits inst406 (.A(inst408_menor), .B(inst24_const_out), .Cin(1'b0), .S(inst406_s));  // open: Cout
  sumador_4bits inst342 (.A(inst344_menor), .B(inst24_const_out), .Cin(1'b0), .S(inst342_s));  // open: Cout
  sumador_4bits inst278 (.A(inst280_menor), .B(inst24_const_out), .Cin(1'b0), .S(inst278_s));  // open: Cout
  sumador_4bits inst211 (.A(menor_vecino_15), .B(inst24_const_out), .Cin(1'b0), .S(inst211_s));  // open: Cout
  FFD_4bits inst409 (.clk(clk0), .reset(reset), .D(inst406_s), .Q(Mi_Peso3));
  FFD_4bits inst345 (.clk(clk0), .reset(reset), .D(inst342_s), .Q(Mi_Peso7));
  FFD_4bits inst281 (.clk(clk0), .reset(reset), .D(inst278_s), .Q(Mi_Peso_11_));
  FFD_4bits inst259 (.clk(clk0), .reset(reset), .D(inst211_s), .Q(Mi_Peso15));

  assign veli = veld;

  // Other names for the same wires on the sheet: clk50 = clk0;
  //   dir[31:2] = {Dir_Min15[0], Dir_Min15[1], Dir_Min14[0], Dir_Min14[1], Dir_Min13[0], Dir_Min13[1], Dir_Min12[0], Dir_Min12[1], Dir_Min_11_[0], Dir_Min_11_[1], Dir_Min_10_[0], Dir_Min_10_[1], Dir_Min9[0], Dir_Min9[1], Dir_Min8[0], Dir_Min8[1], Dir_Min7[0], Dir_Min7[1], Dir_Min6[0], Dir_Min6[1], Dir_Min5[0], Dir_Min5[1], Dir_Min4[0], Dir_Min4[1], Dir_Min3[0], Dir_Min3[1], Dir_Min2[0], Dir_Min2[1], Dir_Min_1_[0], Dir_Min_1_[1]};
  //   hay_pared_ = paredcita; PWM_40KHz_75% = veld
endmodule
